# EAGLE design Uni-2.3 (EAGLE 9.6.2)

## Sheet 1 of 4
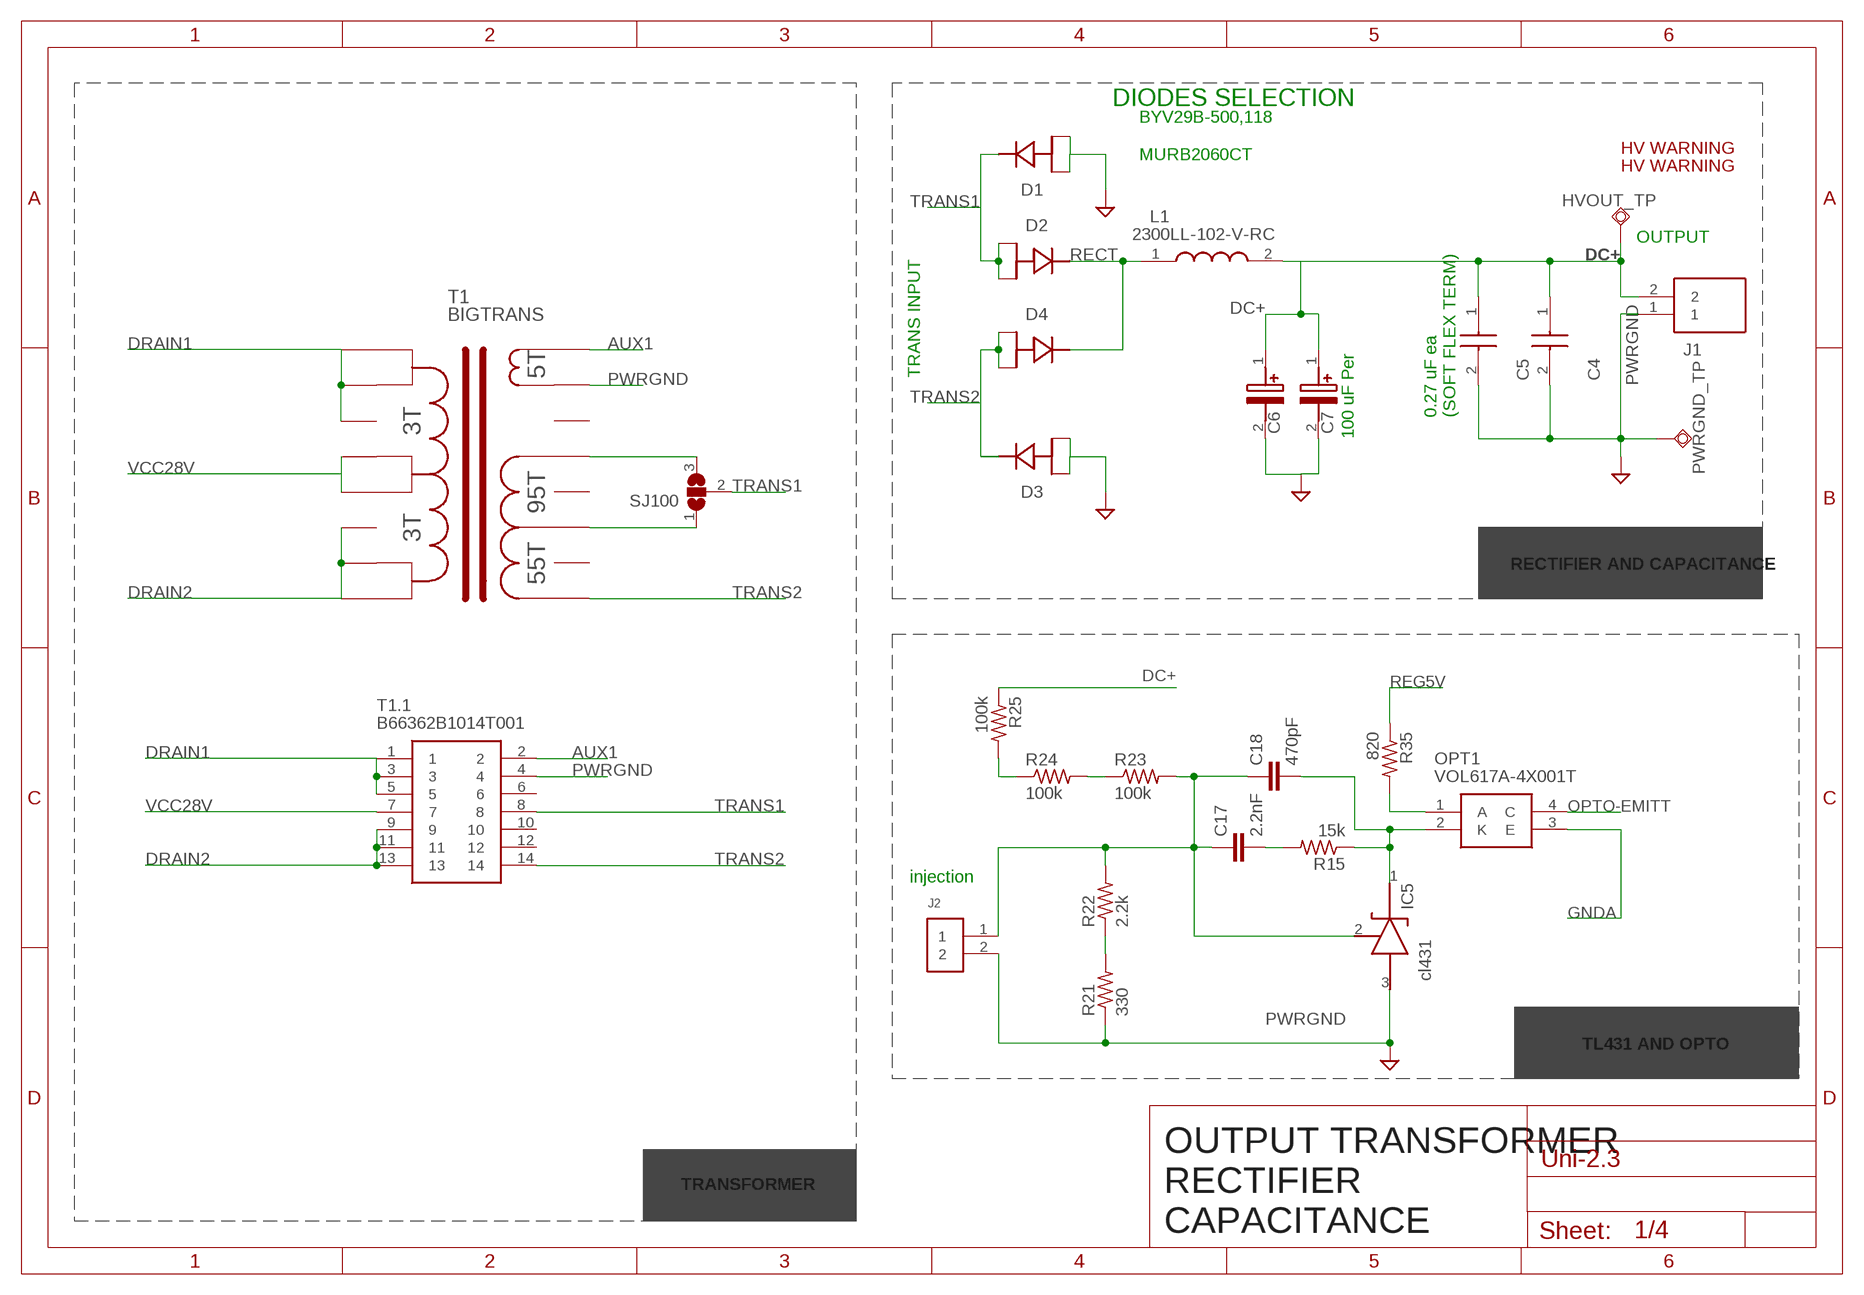
[diagram p0: schematic, sheet 1]

### Parts
C4  C1812C274KCRACAUTO  [C1812]
C5  C1812C274KCRACAUTO  [C1812]
C6  400BXW100MEFR18X25  [CAPPRD750W80D1825H2700]
C7  400BXW100MEFR18X25  [CAPPRD750W80D1825H2700]
C17  2.2nF  C-EUC0603K  [C0603K]
C18  470pF  C-EUC0603K  [C0603K]
D1  FERD20H60CG-TR  [STB20N95K5]
D2  FERD20H60CG-TR  [STB20N95K5]
D3  FERD20H60CG-TR  [STB20N95K5]
D4  FERD20H60CG-TR  [STB20N95K5]
HVOUT_TP  TPSQPAD1-13  [P1-13]
IC5  cl431  TL431CL3T  [SOT95P237X112-3N]
J1  TB005-762-02BE  [TB00576202BE]
J2  61300211121  [61300211121]
L1  2300LL-102-V-RC  [2300LL102VRC]
OPT1  VOL617A-4X001T  [SOP254P1015X230-4N]
PWRGND_TP  TPSQPAD1-13  [P1-13]
R15  15k  R-US_R0603  [R0603]
R21  330  R-US_R0805  [R0805]
R22  2.2k  R-US_R0805  [R0805]
R23  100k  R-US_R1206  [R1206]
R24  100k  R-US_R1206  [R1206]
R25  100k  R-US_R1206  [R1206]
R35  820  R-US_R0603  [R0603]
SJ100  SJ2WW  [SJ_2W]
T1  BIGTRANS  [BIGTRANS!]
T1.1  B66362B1014T001  [B66362B1014T001]
U$3  HV  [PSFBC_ELECTRIC_SHOCK]
U$4  HV  [PSFBC_ELECTRIC_SHOCK]

### Nets
AUX1: T1.1.2 T1.16 ; also sheet 3
DC+: C4.1 C5.1 C6.1(+) C7.1(+) HVOUT_TP.TP J1.2 L1.2 R25.1 ; also sheet 2
DRAIN1: T1.1.1 T1.1.3 T1.1.5 T1.6 T1.7 T1.8 ; also sheet 4
DRAIN2: T1.1 T1.1.9 T1.1.11 T1.1.13 T1.2 T1.3 ; also sheet 4
GNDA: OPT1.3(E) ; also sheet 3,4
N$1: R24.1 R25.2
N$3: C17.1 C18.1 IC5.2(REF) J2.1 R22.2 R23.2
N$9: SJ100.1 T1.11
N$15: R23.1 R24.2
N$16: R21.2 R22.1
N$18: C18.2 IC5.1(CATHODE) OPT1.2(K) R15.1
N$19: OPT1.1(A) R35.2
N$21: C17.2 R15.2
N$25: SJ100.3 T1.13
OPTO-EMITT: OPT1.4(C) ; also sheet 4
PWRGND: C4.2 C5.2 C6.2(-) C7.2(-) D1.1(A1) D1.3(A2) D3.1(A1) D3.3(A2) IC5.3(ANODE) J1.1 J2.2 PWRGND_TP.TP R21.1 T1.1.4 T1.15 ; supply symbol labelled GND ; also sheet 2,3
RECT: D2.2(K) D4.2(K) L1.1
REG5V: R35.1 ; also sheet 3
TRANS1: D1.2(K) D2.1(A1) D2.3(A2) SJ100.2 T1.1.8
TRANS2: D3.2(K) D4.1(A1) D4.3(A2) T1.1.14 T1.9
VCC28V: T1.1.7 T1.4 T1.5 ; also sheet 3,4
Unconnected: T1.1.6 T1.1.10 T1.1.12 T1.10 T1.12 T1.14

### Notes on the sheet
- DIODES SELECTION
- BYV29B-500,118
  
  MURB2060CT
- OUTPUT
- TRANS INPUT
- 0.27 uF ea
  (SOFT FLEX TERM)
- 100 uF Per
- RECTIFIER AND CAPACITANCE
- injection
- TL431 AND OPTO
- TRANSFORMER
- OUTPUT TRANSFORMER
  RECTIFIER
  CAPACITANCE

## Sheet 2 of 4
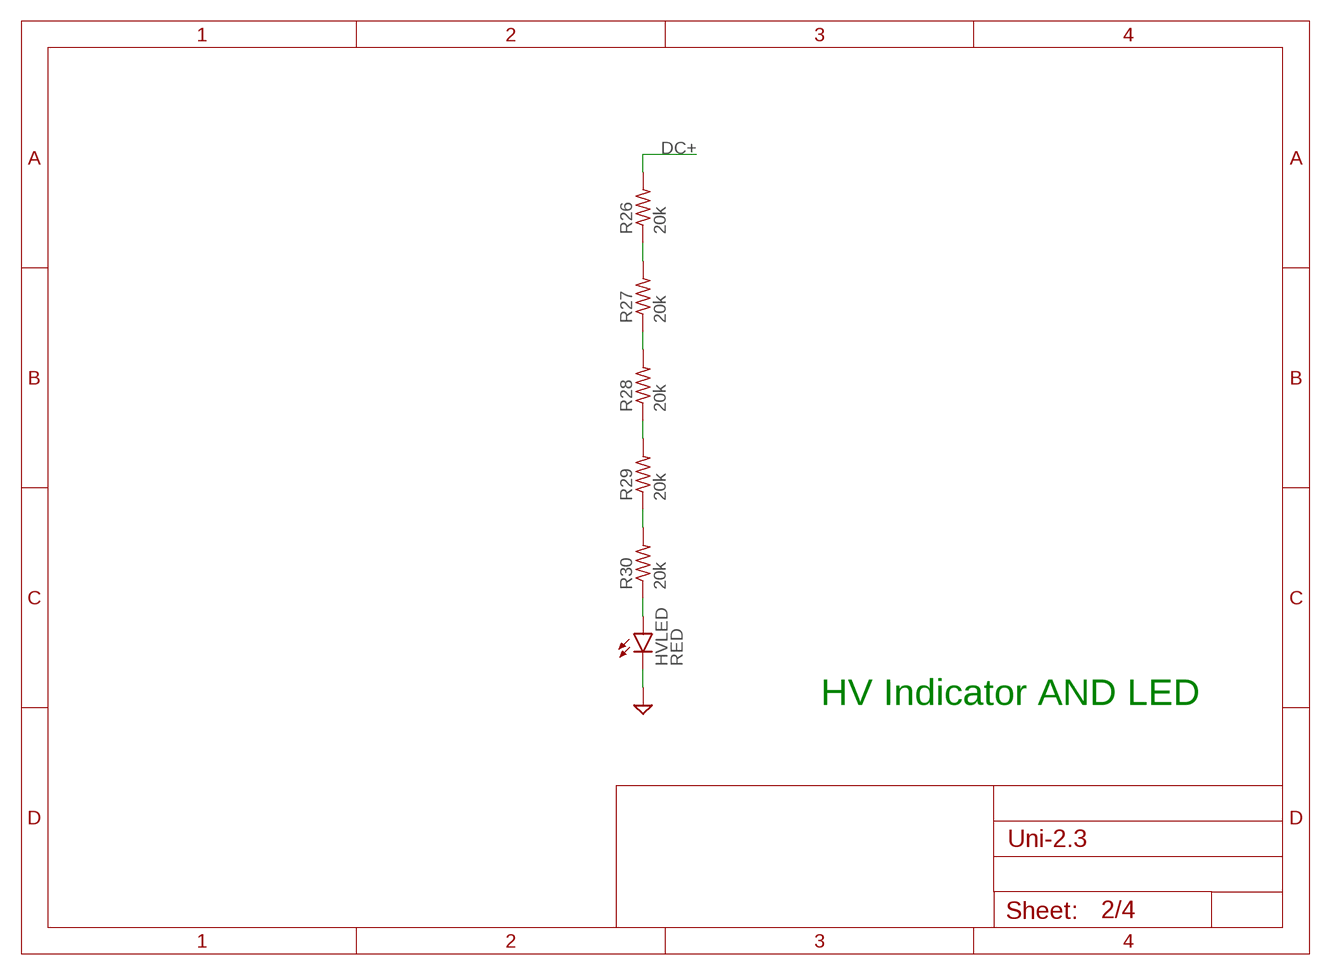
[diagram p1: schematic, sheet 2]

### Parts
HVLED  RED  LEDCHIPLED_0805  [CHIPLED_0805]
R26  20k  R-US_R1206  [R1206]
R27  20k  R-US_R1206  [R1206]
R28  20k  R-US_R1206  [R1206]
R29  20k  R-US_R1206  [R1206]
R30  20k  R-US_R1206  [R1206]

### Nets
DC+: R26.2 ; also sheet 1
N$12: HVLED.A R30.1
N$14: R29.1 R30.2
N$17: R28.1 R29.2
N$24: R27.1 R28.2
N$28: R26.1 R27.2
PWRGND: HVLED.C ; supply symbol labelled GND ; also sheet 1,3

### Notes on the sheet
- HV Indicator AND LED

## Sheet 3 of 4
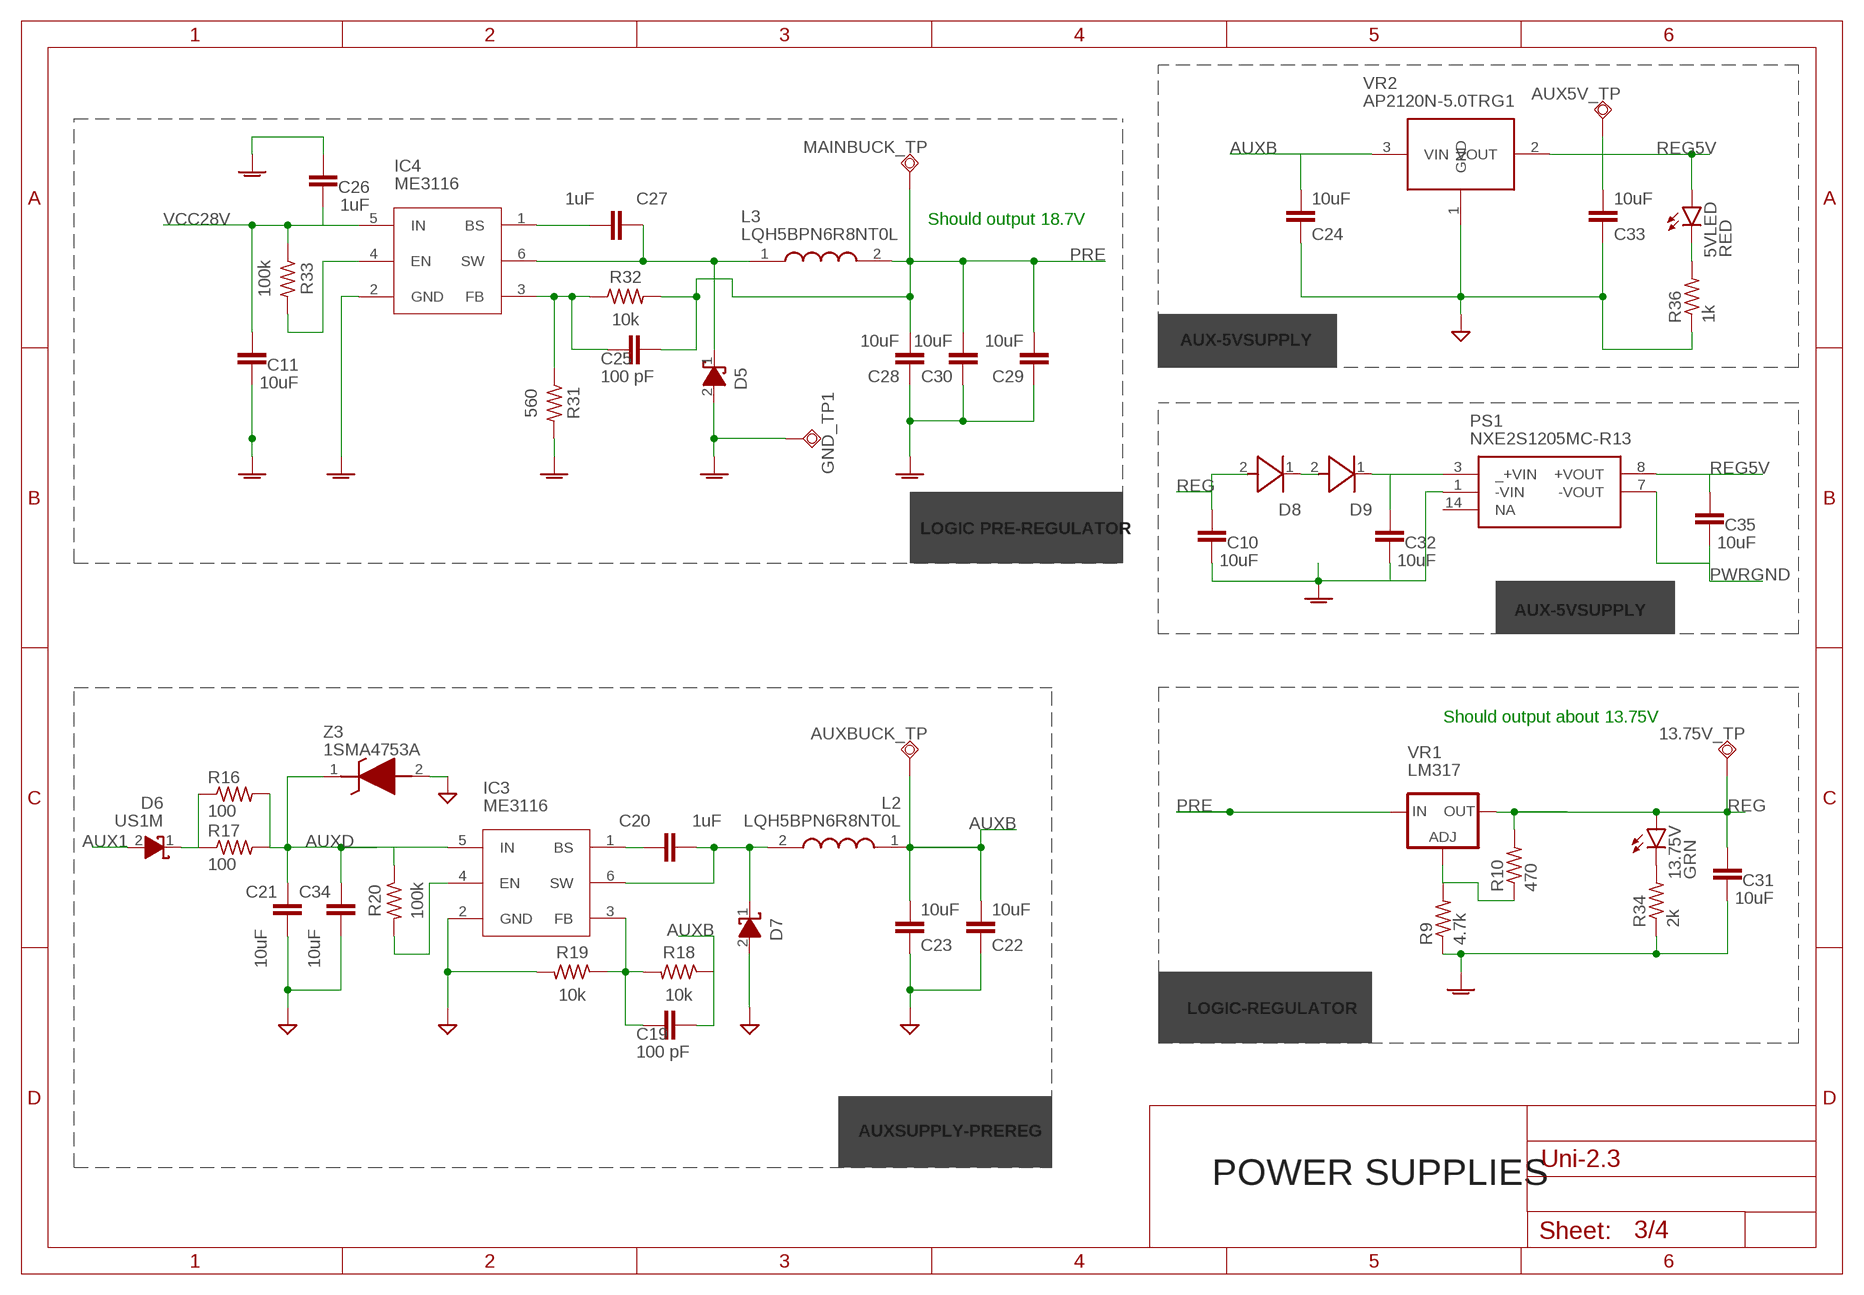
[diagram p2: schematic, sheet 3]

### Parts
5VLED  RED  LEDCHIPLED_0805  [CHIPLED_0805]
13.75V  GRN  LEDCHIPLED_0805  [CHIPLED_0805]
13.75V_TP  TPSQPAD1-17  [P1-17]
AUX5V_TP  TPSQPAD1-17  [P1-17]
AUXBUCK_TP  TPSQPAD1-17  [P1-17]
C10  10uF  C-EUC0805K  [C0805K]
C11  10uF  C-EUC0805K  [C0805K]
C19  100 pF  C-EUC0402K  [C0402K]
C20  1uF  C-EUC0603K  [C0603K]
C21  10uF  C-EUC0805K  [C0805K]
C22  10uF  C-EUC0402  [C0402]
C23  10uF  C-EUC0603K  [C0603K]
C24  10uF  C-EUC0603K  [C0603K]
C25  100 pF  C-EUC0402K  [C0402K]
C26  1uF  C-EUC0603K  [C0603K]
C27  1uF  C-EUC0603K  [C0603K]
C28  10uF  C-EUC0805K  [C0805K]
C29  10uF  C-EUC0805K  [C0805K]
C30  10uF  C-EUC0805K  [C0805K]
C31  10uF  C-EUC0805K  [C0805K]
C32  10uF  C-EUC0603K  [C0603K]
C33  10uF  C-EUC0603K  [C0603K]
C34  10uF  C-EUC0805K  [C0805K]
C35  10uF  C-EUC0603K  [C0603K]
D5  SCHOTTKY  [DIOM5127X229N]
D6  US1M  SCHOTTKY  [DIOM5127X229N]
D7  SCHOTTKY  [DIOM5127X229N]
D8  SM4007PL  1N4148W-7-F  [SOD3716X145N]
D9  SM4007PL  1N4148W-7-F  [SOD3716X145N]
GND_TP1  TPSQPAD1-13  [P1-13]
IC3  ME3116  [SOT95P280X100-6N]
IC4  ME3116  [SOT95P280X100-6N]
L2  LQH5BPN6R8NT0L  [LQH5BPB100MT0L]
L3  LQH5BPN6R8NT0L  [LQH5BPB100MT0L]
MAINBUCK_TP  TPSQPAD1-17  [P1-17]
PS1  NXE2S1205MC-R13  [NXE2S1205MCR13]
R9  4.7k  R-US_R0603  [R0603]
R10  470  R-US_R0603  [R0603]
R16  100  R-US_R1206  [R1206]
R17  100  R-US_R1206  [R1206]
R18  10k  R-US_R0402  [R0402]
R19  10k  R-US_R0402  [R0402]
R20  100k  R-US_R0402  [R0402]
R31  560  R-US_R0402  [R0402]
R32  10k  R-US_R0402  [R0402]
R33  100k  R-US_R0402  [R0402]
R34  2k  R-US_R0603  [R0603]
R36  1k  R-US_R0603  [R0603]
VR1  LM317  LM317MBDT  [DPACK]
VR2  AP2120N-5.0TRG1  [SOT95P240X120-3N]
Z3  1SMA4753A  1SMA5942BT3G  [DIOM5226X220N]

### Nets
AUX1: D6.2(A) ; also sheet 1
AUXB: AUXBUCK_TP.TP C19.1 C22.2 C23.2 C24.2 L2.1 R18.1 VR2.3(VIN)
AUXD: C21.1 C34.1 IC3.5(IN) R16.2 R17.2 R20.1 Z3.1(K)
BS1: C27.2 IC4.1(BS)
BS2: C20.1 IC3.1(BS)
EN1: IC4.4(EN) R33.2
EN2: IC3.4(EN) R20.2
FB1: C25.2 IC4.3(FB) R31.1 R32.1
FB2: C19.2 IC3.3(FB) R18.2 R19.1
GNDA: C10.1 C11.1 C26.2 C28.1 C29.1 C30.1 C31.1 C32.1 D5.2(A) GND_TP1.TP IC4.2(GND) PS1.1(-VIN) R9.1 R31.2 R34.1 ; also sheet 1,4
N$4: D8.1(K) D9.2(A)
N$10: R9.2 R10.1 VR1.1(ADJ)
N$11: C32.2 D9.1(K) PS1.3(_+VIN)
N$22: 13.75V.C R34.2
N$26: 5VLED.C R36.2
N$27: D6.1(K) R16.1 R17.1
PRE: C25.1 C28.2 C29.2 C30.2 L3.2 MAINBUCK_TP.TP R32.2 VR1.3(IN)
PWRGND: C21.2 C22.1 C23.1 C24.1 C33.1 C34.2 C35.1 D7.2(A) IC3.2(GND) PS1.7(-VOUT) R19.2 R36.1 VR2.1(GND) Z3.2(A) ; supply symbol labelled GND ; also sheet 1,2
REG: 13.75V.A 13.75V_TP.TP C10.2 C31.2 D8.2(A) R10.2 VR1.4(OUT) ; also sheet 4
REG5V: 5VLED.A AUX5V_TP.TP C33.2 C35.2 PS1.8(+VOUT) VR2.2(VOUT) ; also sheet 1
SWITCH1: C27.1 D5.1(K) IC4.6(SW) L3.1
SWITCH2: C20.2 D7.1(K) IC3.6(SW) L2.2
VCC28V: C11.2 C26.1 IC4.5(IN) R33.1 ; also sheet 1,4
Unconnected: PS1.14(NA)

### Notes on the sheet
- Should output 18.7V
- AUX-5VSUPPLY
- LOGIC PRE-REGULATOR
- AUX-5VSUPPLY
- Should output about 13.75V
- LOGIC-REGULATOR
- AUXSUPPLY-PREREG
- POWER SUPPLIES

## Sheet 4 of 4
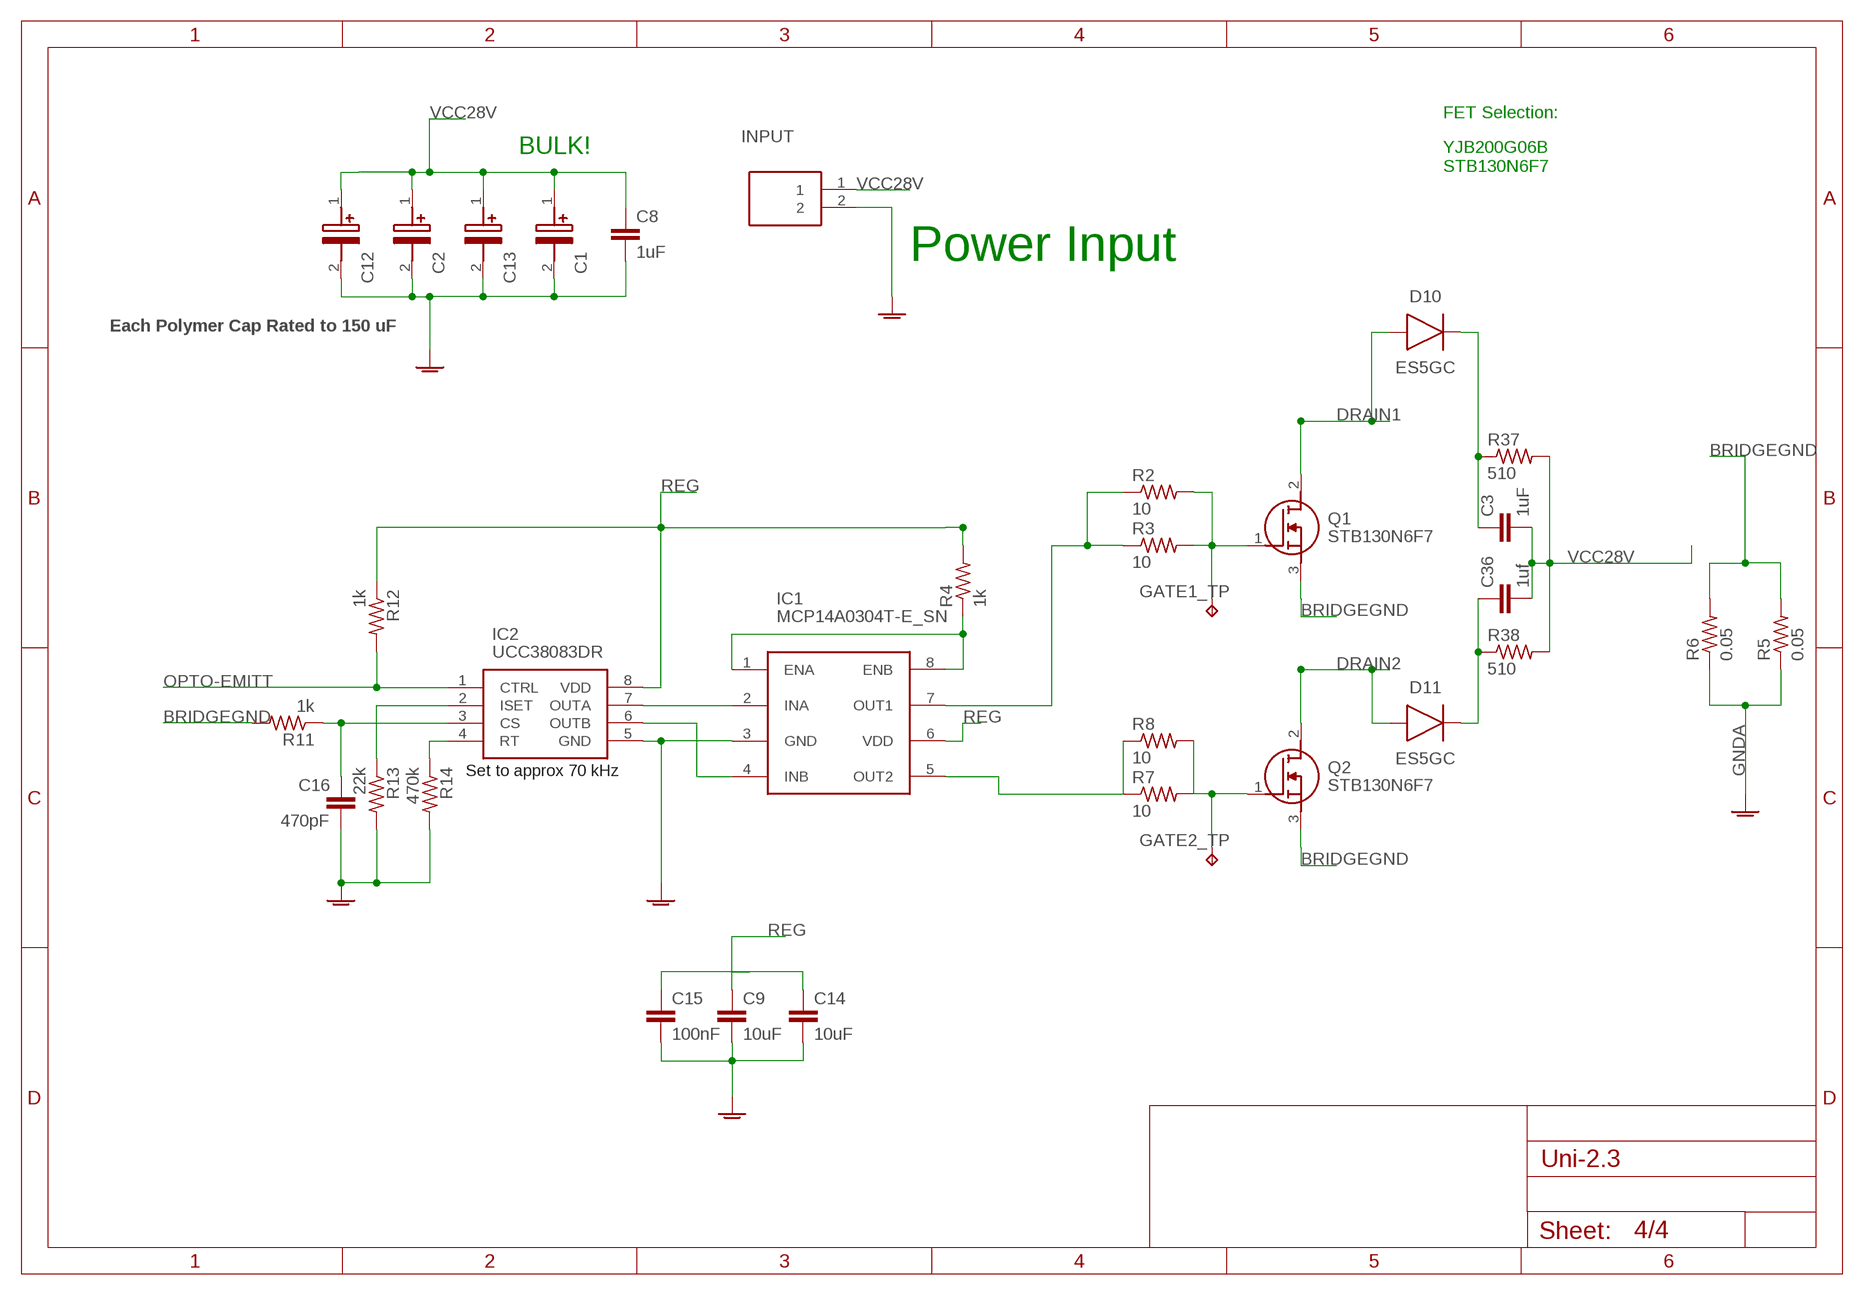
[diagram p3: schematic, sheet 4]

### Parts
C1  OVK151M1VTR-10131  [16SVF1000M]
C2  OVK151M1VTR-10131  [16SVF1000M]
C3  1uF  C-EUC1206K  [C1206K]
C8  1uF  C-EUC0805K  [C0805K]
C9  10uF  C-EUC0603K  [C0603K]
C12  OVK151M1VTR-10131  [16SVF1000M]
C13  OVK151M1VTR-10131  [16SVF1000M]
C14  10uF  C-EUC0603K  [C0603K]
C15  100nF  C-EUC0603K  [C0603K]
C16  470pF  C-EUC0603K  [C0603K]
C36  1uf  C-EUC1206K  [C1206K]
D10  ES5GC  DIODEDO-214AC(SMA)  [DIOM5226X290N]
D11  ES5GC  DIODEDO-214AC(SMA)  [DIOM5226X290N]
GATE1_TP  TPTP13R  [TP13R]
GATE2_TP  TPTP13R  [TP13R]
IC1  MCP14A0304T-E_SN  [SOIC127P600X175-8N]
IC2  UCC38083DR  [SOIC127P600X175-8N]
INPUT  TB005-762-02BE  [TB00576202BE]
Q1  STB130N6F7  [D2PAK]
Q2  STB130N6F7  [D2PAK]
R2  10  R-US_R0805  [R0805]
R3  10  R-US_R0805  [R0805]
R4  1k  R-US_R0402  [R0402]
R5  0.05  R-US_R2512  [R2512]
R6  0.05  R-US_R2512  [R2512]
R7  10  R-US_R0805  [R0805]
R8  10  R-US_R0805  [R0805]
R11  1k  R-US_R0603  [R0603]
R12  1k  R-US_R0603  [R0603]
R13  22k  R-US_R0603  [R0603]
R14  470k  R-US_R0603  [R0603]
R37  510  R-US_R2512  [R2512]
R38  510  R-US_R2512  [R2512]

### Nets
BRIDGEGND: Q1.3(S) Q2.3(S) R5.2 R6.2 R11.2
CS-IN: C16.1 IC2.3(CS) R11.1
DRAIN1: D10.2(A) Q1.2(D) ; also sheet 1
DRAIN2: D11.2(A) Q2.2(D) ; also sheet 1
GNDA: C1.2(-) C2.2(-) C8.2 C9.2 C12.2(-) C13.2(-) C14.2 C15.2 C16.2 IC1.3(GND) IC2.5(GND) INPUT.2 R5.1 R6.1 R13.2 R14.2 ; also sheet 1,3
N$2: IC1.2(INA) IC2.7(OUTA)
N$5: IC1.4(INB) IC2.6(OUTB)
N$6: IC1.1(ENA) IC1.8(ENB) R4.1
N$7: IC1.7(OUT1) R2.1 R3.1
N$8: IC1.5(OUT2) R7.1 R8.1
N$13: IC2.2(ISET) R13.1
N$20: C3.1 D10.1(C) R37.1
N$23: C36.1 D11.1(C) R38.1
OPTO-EMITT: IC2.1(CTRL) R12.2 ; also sheet 1
Q1G: GATE1_TP.TP Q1.1(G) R2.2 R3.2
Q2G: GATE2_TP.TP Q2.1(G) R7.2 R8.2
REG: C9.1 C14.1 C15.1 IC1.6(VDD) IC2.8(VDD) R4.2 R12.1 ; also sheet 3
RT: IC2.4(RT) R14.1
VCC28V: C1.1(+) C2.1(+) C3.2 C8.1 C12.1(+) C13.1(+) C36.2 INPUT.1 R37.2 R38.2 ; also sheet 1,3

### Notes on the sheet
- FET Selection:
- BULK!
- YJB200G06B
  STB130N6F7
- Power Input
- Each Polymer Cap Rated to 150 uF
- Set to approx 70 kHz

## Library data of the parts
5VLED 13.75V = led:LED: LED OSRAM: - CHIPLED LG R971, LG N971, LY N971, LG Q971, LY Q971, LO R971, LY R971 LH N974, LH R974 LS Q976, LO Q976, LY Q976 LO Q996 - Hyper CHIPLED LW Q18S LB Q993, LB Q99A, LB R99A - SideLED LS A670, LO A670, LY A670, LG A670, LP A670 LB A673, LV A673, LT A673, LW A673 LH A674 LY A675 LS A676, LA A676, LO A676, LY A676, LW A676 LS A679, LY A679, LG A679 - Hyper Micro SIDELED® LS Y876, LA Y876, LO Y876, LY Y876 LT Y87S - SmartLED LW L88C, LW L88S LB L89C, LB L89S, LG L890 LS L89K, LO L89K, LY L89K LS L896, LA L896, LO L896, LY L896 - TOPLED LS T670, LO T670, LY T670, LG T670, LP T670 LSG T670, LSP T670, LSY T670, LOP T670, LYG T670 LG T671, LOG T671, LSG T671 LB T673, LV T673, LT T673, LW T673 LH T674 LS T676, LA T676, LO T676, LY T676, LB T676, LH T676, LSB T676, LW T676 LB T67C, LV T67C, LT T67C, LS T67K, LO T67K, LY T67K, LW E67C LS E67B, LA E67B, LO E67B, LY E67B, LB E67C, LV E67C, LT E67C LW T67C LS T679, LY T679, LG T679 LS T770, LO T770, LY T770, LG T770, LP T770 LB T773, LV T773, LT T773, LW T773 LH T774 LS E675, LA E675, LY E675, LS T675 LS T776, LA T776, LO T776, LY T776, LB T776 LHGB T686 LT T68C, LB T68C - Hyper Mini TOPLED® LB M676 - Mini TOPLED Santana® LG M470 LS M47K, LO M47K, LY M47K Source: http://www.osram.convergy.de LUXEON: - LUMILED® LXK2-PW12-R00, LXK2-PW12-S00, LXK2-PW14-U00, LXK2-PW14-V00 LXK2-PM12-R00, LXK2-PM12-S00, LXK2-PM14-U00 LXK2-PE12-Q00, LXK2-PE12-R00, LXK2-PE12-S00, LXK2-PE14-T00, LXK2-PE14-U00 LXK2-PB12-K00, LXK2-PB12-L00, LXK2-PB12-M00, LXK2-PB14-N00, LXK2-PB14-P00, LXK2-PB14-Q00 LXK2-PR12-L00, LXK2-PR12-M00, LXK2-PR14-Q00, LXK2-PR14-R00 LXK2-PD12-Q00, LXK2-PD12-R00, LXK2-PD12-S00 LXK2-PH12-R00, LXK2-PH12-S00 LXK2-PL12-P00, LXK2-PL12-Q00, LXK2-PL12-R00 Source: www.luxeon.com KINGBRIGHT: KA-3528ASYC Source: www.kingbright.com; LCSC_PART: C72043
13.75V_TP AUX5V_TP AUXBUCK_TP GND_TP1 HVOUT_TP MAINBUCK_TP PWRGND_TP = testpad:TPSQ: Test pad
C1 C2 C12 C13 = SamacSys_Parts:OVK151M1VTR-1013: OVK151M1VTR-1013
C3 C17 C18 C21 C33 C34 C36 = rcl:C-EU: CAPACITOR, European symbol; SPICEPREFIX: C
C4 C5 = SamacSys_Parts:C1812C274KCRACAUTO: SMD Auto X7R HV, Ceramic, 0.27 uF, 10%, 500 VDC, 750 VDC, 125?C, -55?C, X7R, SMD, MLCC, High Voltage, Temperature Stable, Automotive Grade, 2.5 % , 370.4 MOhms, 185 mg, 1812, 4.5mm, 3.2mm, 1.9mm, 0.6mm, 500, 78 Weeks, 80 Source: Datasheet <https://componentsearchengine.com/Datasheets/1/C1812C274KCRACAUTO.pdf>; DESCRIPTION: SMD Auto X7R HV, Ceramic, 0.27 uF, 10%, 500 VDC, 750 VDC, 125?C, -55?C, X7R, SMD, MLCC, High Voltage, Temperature Stable, Automotive Grade, 2.5 % , 370.4 MOhms, 185 mg, 1812, 4.5mm, 3.2mm, 1.9mm, 0.6mm, 500, 78 Weeks, 80; HEIGHT: 1.55mm; MANUFACTURER_NAME: KEMET; MANUFACTURER_PART_NUMBER: C1812C274KCRACAUTO; MOUSER_PART_NUMBER: 80-C1812C274KCRAUTO; MOUSER_PRICE-STOCK: https://www.mouser.com/Search/Refine.aspx?Keyword=80-C1812C274KCRAUTO
C6 C7 = SamacSys_Parts:400BXW100MEFR18X25: Aluminum Electrolytic Capacitors - Radial Leaded LONG LIFE ELECTROLYTIC CAPACITORS Source: Datasheet <http://www.rubycon.co.jp/en/catalog/e_pdfs/aluminum/e_BXW.pdf>; DESCRIPTION: Aluminum Electrolytic Capacitors - Radial Leaded LONG LIFE ELECTROLYTIC CAPACITORS; HEIGHT: 27mm; MANUFACTURER_NAME: Rubycon; MANUFACTURER_PART_NUMBER: 400BXW100MEFR18X25
C8 C9 C14 C15 C22-C24 C26 C32 C35 = rcl:C-EU: CAPACITOR, European symbol; LCSC_PART: C440198; SPICEPREFIX: C
C10 C11 C28-C31 = rcl:C-EU: CAPACITOR, European symbol; LCSC_PART: C440198
C16 = rcl:C-EU: CAPACITOR, European symbol; LCSC_PART: C1620; SPICEPREFIX: C
C19 C25 = rcl:C-EU: CAPACITOR, European symbol; LCSC_PART: C1546; SPICEPREFIX: C
C20 C27 = rcl:C-EU: CAPACITOR, European symbol; LCSC_PART: C14663; SPICEPREFIX: C
D1-D4 = SamacSys_Parts:FERD20H60CG-TR: Rectifiers Field-Effect Rectifier Diode 60V Source: Datasheet <https://www.st.com/resource/en/datasheet/ferd20h60c.pdf>; DESCRIPTION: Rectifiers Field-Effect Rectifier Diode 60V; HEIGHT: 4mm; MANUFACTURER_NAME: STMicroelectronics; MANUFACTURER_PART_NUMBER: FERD20H60CG-TR; MOUSER_PART_NUMBER: 511-FERD20H60CG-TR; MOUSER_PRICE-STOCK: https://www.mouser.co.uk/ProductDetail/STMicroelectronics/FERD20H60CG-TR?qs=1mbolxNpo8ebHpKodyoUCQ%3D%3D
D5 D7 = SamacSys_Parts:SCHOTTKY: Schottky Diodes & Rectifiers 60V Sctky Bar Rectfr SMA (DO-214AC) Source: Datasheet <https://www.arrow.com/en/products/ss16he3-bh/vishay>; DESCRIPTION: Schottky Diodes & Rectifiers 60V Sctky Bar Rectfr SMA (DO-214AC); HEIGHT: 2.29mm; LCSC_PART: C22452; MANUFACTURER_NAME: Vishay; MANUFACTURER_PART_NUMBER: SS16HE3_B/H; MOUSER_PART_NUMBER: 78-SS16HE3_B/H; MOUSER_PRICE-STOCK: https://www.mouser.co.uk/ProductDetail/Vishay-General-Semiconductor/SS16HE3_B-H?qs=MLItCLRbWsyJmaJ87KUvIw%3D%3D
D6 = SamacSys_Parts:SCHOTTKY: Schottky Diodes & Rectifiers 60V Sctky Bar Rectfr SMA (DO-214AC) Source: Datasheet <https://www.arrow.com/en/products/ss16he3-bh/vishay>; DESCRIPTION: Schottky Diodes & Rectifiers 60V Sctky Bar Rectfr SMA (DO-214AC); HEIGHT: 2.29mm; MANUFACTURER_NAME: Vishay; MANUFACTURER_PART_NUMBER: SS16HE3_B/H; MOUSER_PART_NUMBER: 78-SS16HE3_B/H; MOUSER_PRICE-STOCK: https://www.mouser.co.uk/ProductDetail/Vishay-General-Semiconductor/SS16HE3_B-H?qs=MLItCLRbWsyJmaJ87KUvIw%3D%3D
D8 D9 = SamacSys_Parts:1N4148W-7-F: Diode Switching 150mA 100V 400mW SOD123 Diodes Inc 1N4148W-7-F Switching Diode 100V, 2-Pin SOD-123 Source: Datasheet <https://componentsearchengine.com/Datasheets/2/1N4148W-7-F.pdf>; DESCRIPTION: Diode Switching 150mA 100V 400mW SOD123 Diodes Inc 1N4148W-7-F Switching Diode 100V, 2-Pin SOD-123; HEIGHT: 1.45mm; LCSC_PART: C64898; MANUFACTURER_NAME: Diodes Inc.; MANUFACTURER_PART_NUMBER: 1N4148W-7-F; MOUSER_PART_NUMBER: 621-1N4148W-F; MOUSER_PRICE-STOCK: https://www.mouser.co.uk/ProductDetail/Diodes-Incorporated/1N4148W-7-F?qs=LHX0FizJzg7Ae9ZM8LTAWw%3D%3D
D10 = Diode:DIODE: Diode Rectifier - Generic; CATEGORY: Diode; LCSC_PART: C128705; SUB-CATEGORY: Rectifier; VALUE: DIODE
D11 = Diode:DIODE: Diode Rectifier - Generic; CATEGORY: Diode; SUB-CATEGORY: Rectifier; VALUE: DIODE
GATE1_TP GATE2_TP = testpad:TP: Test pad
HVLED = led:LED: LED OSRAM: - CHIPLED LG R971, LG N971, LY N971, LG Q971, LY Q971, LO R971, LY R971 LH N974, LH R974 LS Q976, LO Q976, LY Q976 LO Q996 - Hyper CHIPLED LW Q18S LB Q993, LB Q99A, LB R99A - SideLED LS A670, LO A670, LY A670, LG A670, LP A670 LB A673, LV A673, LT A673, LW A673 LH A674 LY A675 LS A676, LA A676, LO A676, LY A676, LW A676 LS A679, LY A679, LG A679 - Hyper Micro SIDELED® LS Y876, LA Y876, LO Y876, LY Y876 LT Y87S - SmartLED LW L88C, LW L88S LB L89C, LB L89S, LG L890 LS L89K, LO L89K, LY L89K LS L896, LA L896, LO L896, LY L896 - TOPLED LS T670, LO T670, LY T670, LG T670, LP T670 LSG T670, LSP T670, LSY T670, LOP T670, LYG T670 LG T671, LOG T671, LSG T671 LB T673, LV T673, LT T673, LW T673 LH T674 LS T676, LA T676, LO T676, LY T676, LB T676, LH T676, LSB T676, LW T676 LB T67C, LV T67C, LT T67C, LS T67K, LO T67K, LY T67K, LW E67C LS E67B, LA E67B, LO E67B, LY E67B, LB E67C, LV E67C, LT E67C LW T67C LS T679, LY T679, LG T679 LS T770, LO T770, LY T770, LG T770, LP T770 LB T773, LV T773, LT T773, LW T773 LH T774 LS E675, LA E675, LY E675, LS T675 LS T776, LA T776, LO T776, LY T776, LB T776 LHGB T686 LT T68C, LB T68C - Hyper Mini TOPLED® LB M676 - Mini TOPLED Santana® LG M470 LS M47K, LO M47K, LY M47K Source: http://www.osram.convergy.de LUXEON: - LUMILED® LXK2-PW12-R00, LXK2-PW12-S00, LXK2-PW14-U00, LXK2-PW14-V00 LXK2-PM12-R00, LXK2-PM12-S00, LXK2-PM14-U00 LXK2-PE12-Q00, LXK2-PE12-R00, LXK2-PE12-S00, LXK2-PE14-T00, LXK2-PE14-U00 LXK2-PB12-K00, LXK2-PB12-L00, LXK2-PB12-M00, LXK2-PB14-N00, LXK2-PB14-P00, LXK2-PB14-Q00 LXK2-PR12-L00, LXK2-PR12-M00, LXK2-PR14-Q00, LXK2-PR14-R00 LXK2-PD12-Q00, LXK2-PD12-R00, LXK2-PD12-S00 LXK2-PH12-R00, LXK2-PH12-S00 LXK2-PL12-P00, LXK2-PL12-Q00, LXK2-PL12-R00 Source: www.luxeon.com KINGBRIGHT: KA-3528ASYC Source: www.kingbright.com
IC1 = SamacSys_Parts:MCP14A0304T-E_SN: Microchip Technology MCP14A0304T-E/SN Dual Low Side MOSFET Power Driver, 3A 8-Pin, SOIC Source: Datasheet <http://www.microchip.com/mymicrochip/filehandler.aspx?ddocname=en606629>; DESCRIPTION: Microchip Technology MCP14A0304T-E/SN Dual Low Side MOSFET Power Driver, 3A 8-Pin, SOIC; HEIGHT: 1.75mm; MANUFACTURER_NAME: Microchip; MANUFACTURER_PART_NUMBER: MCP14A0304T-E/SN; MOUSER_PART_NUMBER: 579-MCP14A0304T-E/SN; MOUSER_PRICE-STOCK: https://www.mouser.co.uk/ProductDetail/Microchip-Technology/MCP14A0304T-E-SN?qs=w%2Fv1CP2dgqqqWUCaoFqV0w%3D%3D
IC2 = SamacSys_Parts:UCC38083DR: Current Mode Push-Pull PWM With Programmable Slope Compensation Source: Datasheet <http://www.ti.com/lit/gpn/ucc38083>; DESCRIPTION: Current Mode Push-Pull PWM With Programmable Slope Compensation; HEIGHT: 1.75mm; MANUFACTURER_NAME: Texas Instruments; MANUFACTURER_PART_NUMBER: UCC38083DR; MOUSER_PART_NUMBER: 595-UCC38083DR; MOUSER_PRICE-STOCK: https://www.mouser.co.uk/ProductDetail/Texas-Instruments/UCC38083DR/?qs=zqbRmZ%252BfZD9Rvt3ie7yhvg%3D%3D
IC3 IC4 = SamacSys_Parts:ME3116; LCSC_PART: C97643
IC5 = SamacSys_Parts:TL431CL3T: Adjustable micropower shunt voltage reference Source: Datasheet <https://www.st.com/resource/en/datasheet/tl431.pdf>; DESCRIPTION: Adjustable micropower shunt voltage reference; HEIGHT: 1.12mm; MANUFACTURER_NAME: STMicroelectronics; MANUFACTURER_PART_NUMBER: TL431CL3T; MOUSER_PART_NUMBER: 511-TL431CL3T; MOUSER_PRICE-STOCK: https://www.mouser.co.uk/ProductDetail/STMicroelectronics/TL431CL3T?qs=L6eUzyzWLAsU2SYO1NdhdA%3D%3D
INPUT J1 = SamacSys_Parts:TB005-762-02BE: Fixed Terminal Blocks screw type, 7.62 , horizontal, 2 poles, CUI Blue, slotted screw, PCB mount Source: Datasheet <https://componentsearchengine.com/Datasheets/1/TB005-762-02BE.pdf>; DESCRIPTION: Fixed Terminal Blocks screw type, 7.62 , horizontal, 2 poles, CUI Blue, slotted screw, PCB mount; HEIGHT: 21.7mm; MANUFACTURER_NAME: CUI Inc.; MANUFACTURER_PART_NUMBER: TB005-762-02BE; MOUSER_PART_NUMBER: 490-TB005-762-02BE; MOUSER_PRICE-STOCK: https://www.mouser.co.uk/ProductDetail/CUI-Devices/TB005-762-02BE?qs=vLWxofP3U2zXv1H2wuShow%3D%3D
J2 = Headers:61300211121: CONN HEADER VERT 2POS 2.54MM Manufacturer's datasheet <https://katalog.we-online.de/em/datasheet/6130xx11121.pdf>; CREATED_BY: PCBLayout.com; DIGI_KEY_PART_NUMBER: 732-5315-ND; MANUFACTURER: Wurth Electronics Inc.; MPN: 61300211121
L1 = SamacSys_Parts:2300LL-102-V-RC: Inductor High Current Toroid 1000uH/378.9uH 15% 1KHz 3.5A 137mOhm DCR RDL Source: Datasheet; DESCRIPTION: Inductor High Current Toroid 1000uH/378.9uH 15% 1KHz 3.5A 137mOhm DCR RDL; HEIGHT: 32.512mm; MANUFACTURER_NAME: Bourns; MANUFACTURER_PART_NUMBER: 2300LL-102-V-RC; MOUSER_PART_NUMBER: 652-2300LL-102-V-RC; MOUSER_PRICE-STOCK: https://www.mouser.co.uk/ProductDetail/Bourns/2300LL-102-V-RC?qs=d7g9p1yFhWZHzfawXthNnQ%3D%3D
L2 L3 = SamacSys_Parts:LQH5BPN6R8NT0L: MURATA - LQH5BPN6R8NT0L - INDUCTOR, 6.8UH, +/-30%, POWER Source: Datasheet <https://psearch.en.murata.com/inductor/product/LQH5BPN6R8NT0#.html>; DESCRIPTION: MURATA - LQH5BPN6R8NT0L - INDUCTOR, 6.8UH, +/-30%, POWER; HEIGHT: 2.2mm; MANUFACTURER_NAME: Murata Electronics; MANUFACTURER_PART_NUMBER: LQH5BPN6R8NT0L; MOUSER_PART_NUMBER: 81-LQH5BPN6R8NT0L0L; MOUSER_PRICE-STOCK: https://www.mouser.co.uk/ProductDetail/Murata-Electronics/LQH5BPN6R8NT0L?qs=3ZwS9AhGA%2F4N8axqd87eRQ%3D%3D
OPT1 = SamacSys_Parts:VOL617A-4X001T: Vishay VOL617A-4X001T DC Input Phototransistor Output Optocoupler, Surface Mount, 4-Pin LSOP Source: Datasheet <https://www.vishay.com/docs/82424/vol617a.pdf>; DESCRIPTION: Vishay VOL617A-4X001T DC Input Phototransistor Output Optocoupler, Surface Mount, 4-Pin LSOP; HEIGHT: 2.3mm; MANUFACTURER_NAME: Vishay; MANUFACTURER_PART_NUMBER: VOL617A-4X001T; MOUSER_PART_NUMBER: 78-VOL617A-4X001T; MOUSER_PRICE-STOCK: https://www.mouser.co.uk/ProductDetail/Vishay-Semiconductors/VOL617A-4X001T?qs=s4XK1XdnRilEoTFGQUoymA%3D%3D
PS1 = SamacSys_Parts:NXE2S1205MC-R13: Isolated DC/DC Converters DC/DC SM 2W 12-5V Single 3kV Source: Datasheet; DESCRIPTION: Isolated DC/DC Converters DC/DC SM 2W 12-5V Single 3kV; HEIGHT: 4.81mm; MANUFACTURER_NAME: Murata Electronics; MANUFACTURER_PART_NUMBER: NXE2S1205MC-R13; MOUSER_PART_NUMBER: 580-NXE2S1205MC-R13; MOUSER_PRICE-STOCK: https://www.mouser.co.uk/ProductDetail/Murata-Power-Solutions/NXE2S1205MC-R13?qs=UqPySVGgRwFuSegQbHt7Hw%3D%3D
Q1 Q2 = SamacSys_Parts:STB130N6F7
R2-R8 R15-R17 R21-R30 R35 R37 R38 = rcl:R-US_: RESISTOR, American symbol; SPICEPREFIX: R
R9 R10 R12 R34 R36 = rcl:R-US_: RESISTOR, American symbol; LCSC_PART: C22975; SPICEPREFIX: R
R11 = rcl:R-US_: RESISTOR, American symbol; LCSC_PART: C21190; SPICEPREFIX: R
R13 = rcl:R-US_: RESISTOR, American symbol; LCSC_PART: C31850; SPICEPREFIX: R
R14 = rcl:R-US_: RESISTOR, American symbol; LCSC_PART: C25811; SPICEPREFIX: R
R18 R19 R32 = rcl:R-US_: RESISTOR, American symbol; LCSC_PART: C25779; SPICEPREFIX: R
R20 R33 = rcl:R-US_: RESISTOR, American symbol; LCSC_PART: C25741; SPICEPREFIX: R
R31 = rcl:R-US_: RESISTOR, American symbol; LCSC_PART: C4177; SPICEPREFIX: R
SJ100 = jumper:SJ2W: SMD solder JUMPER
T1 = SamacSys_Parts:BIGTRANS
T1.1 = SamacSys_Parts:B66362B1014T001: Ferrite Accessories, E Cores Accessories(EFD/ER/ETD), Coil former (ETD 34/17/11) Source: Datasheet <https://product.tdk.com/system/files/dam/doc/product/ferrite/ferrite/ferrite-acc/data_sheet/80/db/fer/etd_34_17_11.pdf>; DESCRIPTION: Ferrite Accessories, E Cores Accessories(EFD/ER/ETD), Coil former (ETD 34/17/11); HEIGHT: 33.1mm; MANUFACTURER_NAME: TDK; MANUFACTURER_PART_NUMBER: B66362B1014T001; MOUSER_PART_NUMBER: 871-B66362B1014T001; MOUSER_PRICE-STOCK: https://www.mouser.co.uk/ProductDetail/EPCOS-TDK/B66362B1014T001?qs=w5o0Loj0u7M9FVK%2Ff7P38g%3D%3D
U$3 U$4 = RMP - HALF BRIDGE 0.0.1:HV
VR1 = v-reg:LM317?*: 500 mA Adjustable Output Positive Voltage Regulator Source: http://www.onsemi.co.jp .. LM317M-D.PDF
VR2 = SamacSys_Parts:AP2120N-5.0TRG1: IC REG LINEAR 5V 150MA SOT23 Source: Datasheet; DESCRIPTION: IC REG LINEAR 5V 150MA SOT23; HEIGHT: 1.2mm; MANUFACTURER_NAME: Diodes Inc.; MANUFACTURER_PART_NUMBER: AP2120N-5.0TRG1; MOUSER_PART_NUMBER: 621-AP2120N-5.0TRG1; MOUSER_PRICE-STOCK: https://www.mouser.co.uk/ProductDetail/Diodes-Incorporated/AP2120N-50TRG1?qs=M%2FOdCRO8QQ3JQu49DdtyIA%3D%3D
Z3 = SamacSys_Parts:1SMA5942BT3G: ON Semiconductor 1SMA5942BT3G Zener Diode, 51V 5% 1.5 W SMT 2-Pin SMA Source: Datasheet <http://www.onsemi.com/pub/Collateral/1SMA5913BT3-D.PDF>; DESCRIPTION: ON Semiconductor 1SMA5942BT3G Zener Diode, 51V 5% 1.5 W SMT 2-Pin SMA; HEIGHT: 2.2mm; LCSC_PART: C362284; MANUFACTURER_NAME: onsemi; MANUFACTURER_PART_NUMBER: 1SMA5942BT3G; MOUSER_PART_NUMBER: 863-1SMA5942BT3G; MOUSER_PRICE-STOCK: https://www.mouser.co.uk/ProductDetail/ON-Semiconductor/1SMA5942BT3G?qs=y2kkmE52mdPrQGqg%252Bfz9yg%3D%3D

## Board
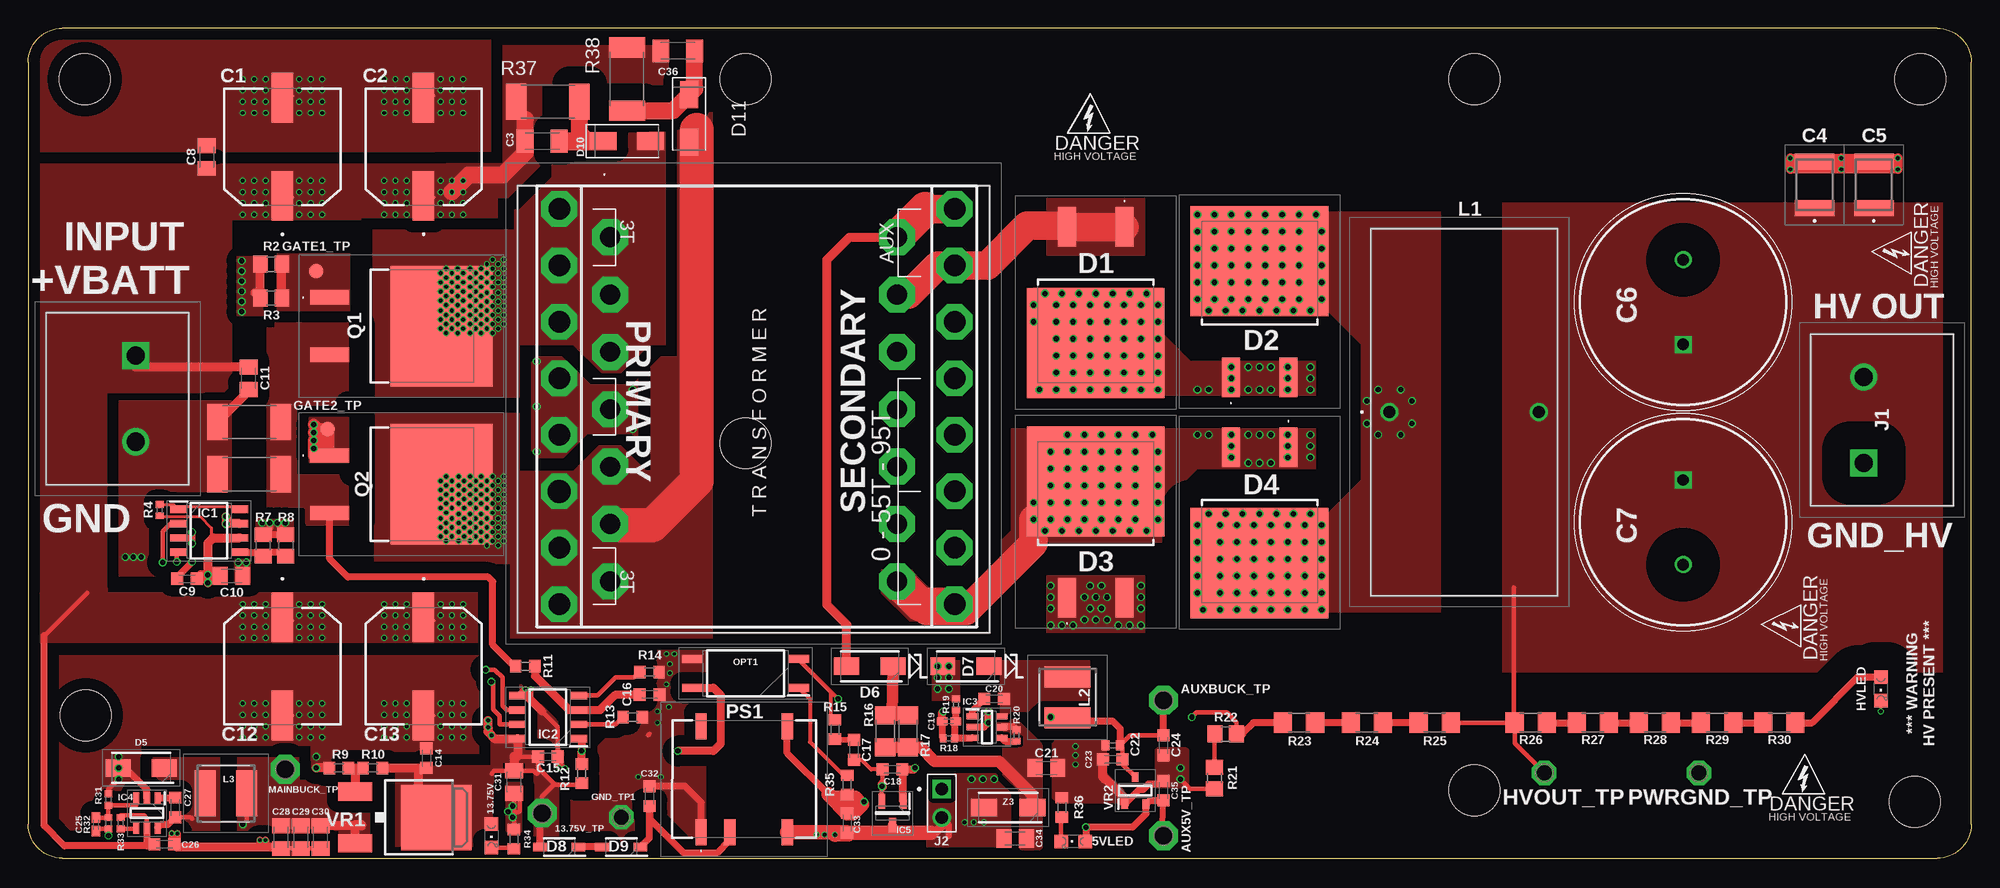
[diagram p4: board, top side]
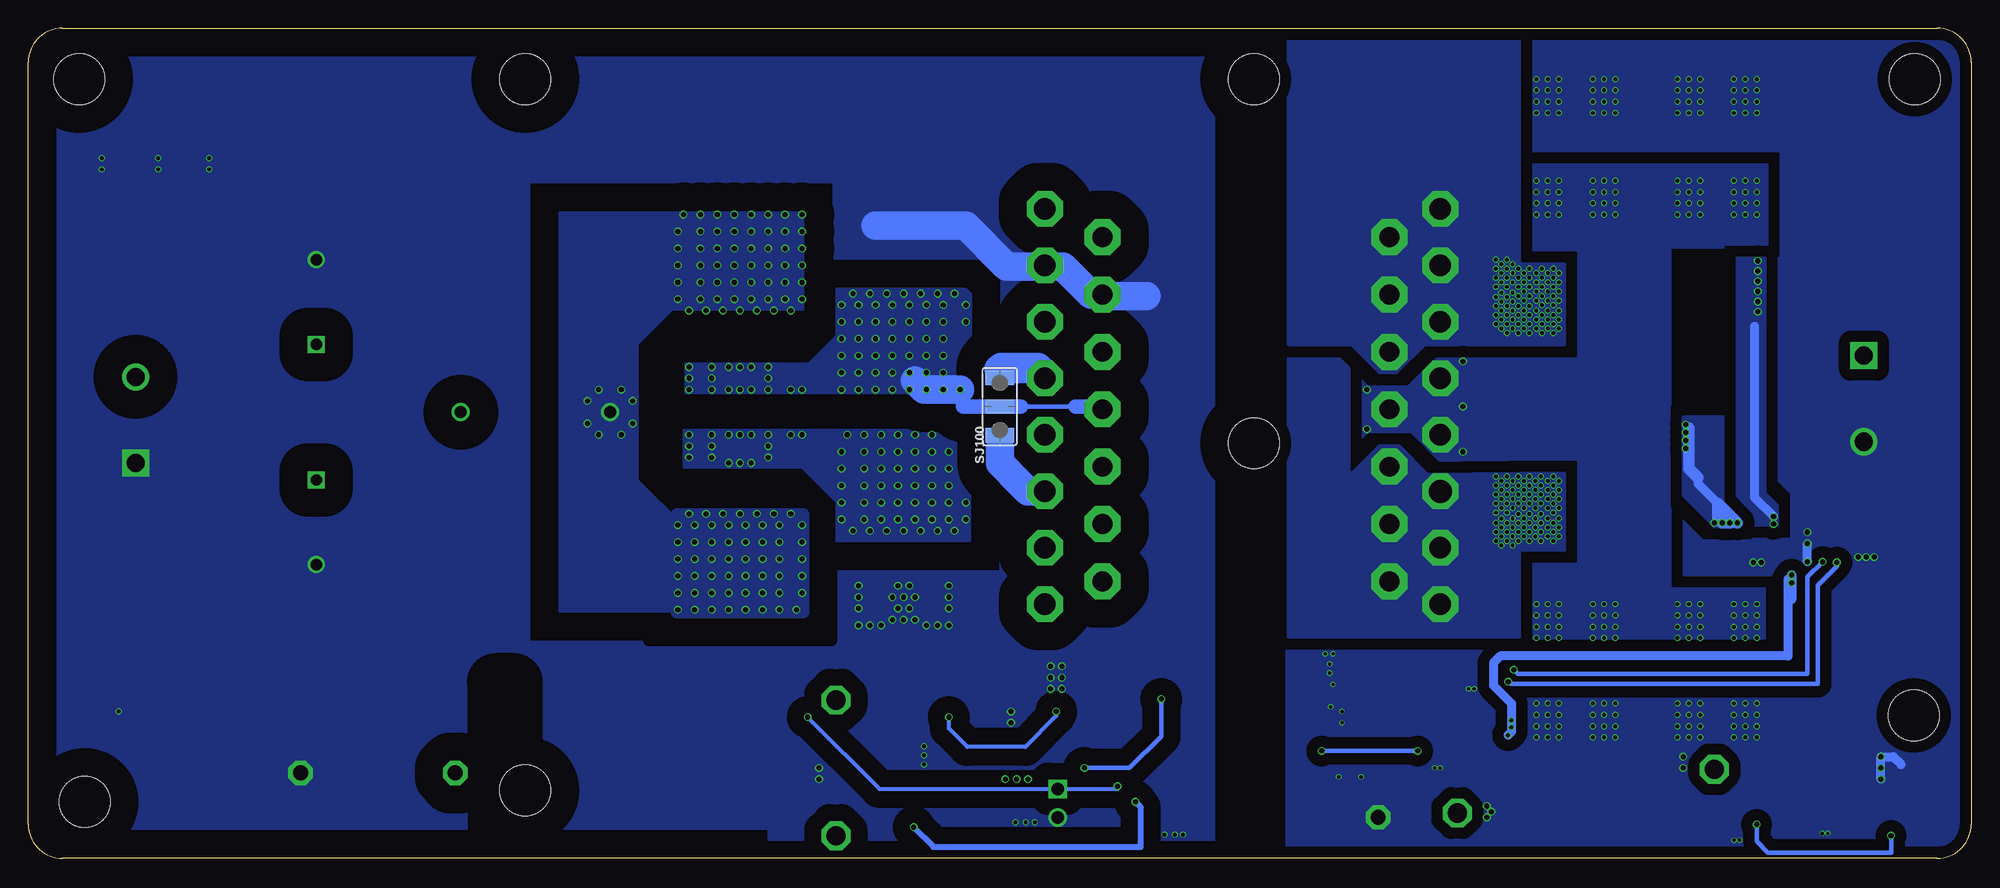
[diagram p5: board, bottom side, seen from below]

Size 172 x 73.5 mm. Coordinates in mm from the lower left corner, seen from the top.
Outline: 3,0 169,0 arc90 172,3 172,70.5 arc90 169,73.5 3,73.5 arc90 0,70.5 0,3 arc90 3,0
Copper layers (1*16): Top 0.035559375mm / dielectric 1.6mm / Bottom 0.035559375mm
Design rules "jlcpcb2layer *": minimum track width 5mil, minimum drill 12mil, track to track 5mil, track to pad 5mil, pad to pad 5mil, via to via 5mil, smd to smd 5mil, copper to edge 8mil, drill to drill 6mil, minimum pad ring 5mil, minimum via ring 3mil, stop-mask expansion 2.5mil, vias tented up to drill 30mil, thermal gap 10mil
Holes 4.5 mm at 63.5,69 5,69 128,69 167.5,69 167,5 128,6 63.5,36.75 5.1,12.65
tRestrict: 5 lines
bRestrict: 3 lines

### Footprints (pad centres in the part's own frame; a part is rotated, then mirrored left to right if it is on the bottom)
CHIPLED_0805 = smd 1.2 x 1.2: A 0,-1.05; C 0,1.05
P1-17 = drill 1.702 pad 2.54 octagon: TP 0,0
16SVF1000M = smd 1.9 x 4.4: 1 0,-4.35; 2 0,4.35
C1206K = smd 1.5 x 2: 1 -1.5,0; 2 1.5,0
C1812 = smd 1.4 x 3.5: 1 -2.05,0; 2 2.05,0
CAPPRD750W80D1825H2700 = drill 1 pad 1.5 square: 1 0,0 | drill 1 pad 1.5: 2 7.5,0
C0805K = smd 1.3 x 1.6: 1 -1,0; 2 1,0
C0603K = smd 1.05 x 1.08: 1 -0.875,0; 2 0.875,0
C0402K = smd 0.925 x 0.74: 1 -0.6,0; 2 0.6,0
C0402 = smd 0.7 x 0.9: 1 -0.65,0; 2 0.65,0
STB20N95K5 = smd 1.6 x 3.5: 1 -2.54,-6.907; 3 2.54,-6.907 | smd 12.2 x 9.75: 2 0,3.368
DIOM5127X229N = smd 2.2 x 1.55: 1 -2.05,0; 2 2.05,0
SOD3716X145N = smd 1.2 x 0.75: 1 -1.7,0; 2 1.7,0
DIOM5226X290N = smd 2.392 x 1.565: 1 -2.108,0; 2 2.108,0
TP13R = smd 1.3 x 1.3: TP 0,0
P1-13 = drill 1.321 pad 2.159 octagon: TP 0,0
SOIC127P600X175-8N = smd 1.5 x 0.65: 1 -2.7,1.905; 2 -2.7,0.635; 3 -2.7,-0.635; 4 -2.7,-1.905; 5 2.7,-1.905; 6 2.7,-0.635; 7 2.7,0.635; 8 2.7,1.905
SOT95P280X100-6N = smd 1.05 x 0.55: 1 -1.3,0.95; 2 -1.3,0; 3 -1.3,-0.95; 4 1.3,-0.95; 5 1.3,0; 6 1.3,0.95
SOT95P237X112-3N = smd 1.3 x 0.6: 1 -1.05,0.95; 2 -1.05,-0.95; 3 1.05,0
TB00576202BE = drill 1.6 pad 2.4 square: 1 0,0 | drill 1.6 pad 2.4: 2 7.62,0
61300211121 = drill 1.1 square: 1 -1.27,0 | drill 1.1: 2 1.27,0
2300LL102VRC = drill 1.06 pad 1.59: 1 0,0; 2 13.208,0
LQH5BPB100MT0L = smd 1.85 x 4.1: 1 -1.825,0; 2 1.825,0
SOP254P1015X230-4N = smd 1.85 x 0.7: 1 -4.7,1.27; 2 -4.7,-1.27; 3 4.7,-1.27; 4 4.7,1.27
NXE2S1205MCR13 = smd 1 x 2.3: 1 -3.81,-4.7; 3 -1.27,-4.7; 7 3.81,-4.7; 8 3.81,4.7; 14 -3.81,4.7
D2PAK = smd 1.257 x 3.429: 1 -2.54,-8.192; 3 2.54,-8.192 | smd 10.668 x 9.017: 2 0,1.715
R0805 = smd 1.3 x 1.5: 1 -0.95,0; 2 0.95,0
R0402 = smd 0.6 x 0.7: 1 -0.5,0; 2 0.5,0
R2512 = smd 1.8 x 3.2: 1 -2.8,0; 2 2.8,0
R0603 = smd 1 x 1.1: 1 -0.85,0; 2 0.85,0
R1206 = smd 1.6 x 1.803: 1 -1.422,0; 2 1.422,0
SJ_2W = smd 1.27 x 2.54: 1 -2.54,0; 2 0,0; 3 2.54,0
BIGTRANS! = drill 1.905 pad 3.175 octagon: 1 0,0; 2 0,5; 4 0,15; 5 0,20; 6 0,25; 7 0,30; 8 0,35; 9 35,0; 10 35,5; 11 35,10; 12 35,15; 13 35,20; 14 35,25; 15 35,30; 16 35,35 | drill 2.032 pad 3.175 octagon: 3 0,10
B66362B1014T001 = drill 1.75 pad 3.175 octagon: 1 0,0; 2 0,25.4; 3 5.08,0; 4 5.08,25.4; 5 10.16,0; 6 10.16,25.4; 7 15.24,0; 8 15.24,25.4; 9 20.32,0; 10 20.32,25.4; 11 25.4,0; 12 25.4,25.4; 13 30.48,0; 14 30.48,25.4
DPACK = smd 1.6 x 3: 1 -2.28,-4.8; 3 2.28,-4.8 | smd 5.8 x 6.2: 4 0,2.38
SOT95P240X120-3N = smd 0.85 x 0.6: 1 -1.2,0.95; 2 -1.2,-0.95; 3 1.2,0
DIOM5226X220N = smd 2.3 x 1.55: 1 -2.15,0; 2 2.15,0

### Placement (x,y rotation side)
5VLED  92.5,1.5 90 top
13.75V  41,2 180 top
13.75V_TP  45.5,4 270 top
AUX5V_TP  100.5,2 0 top
AUXBUCK_TP  100.5,14 270 top
C1  22.5,63 0 top
C2  35,63 0 top
C3  45.5,63.5 180 top
C4  158.12,59.62 90 top
C5  163.38,59.62 90 top
C6  146.5,45.5 90 top
C7  146.5,33.5 270 top
C8  15.8,62.1 90 top
C9  14.05,24.75 180 top
C10  18,25 180 top
C11  19.5,42.5 90 top
C12  22.5,17 180 top
C13  35,17 180 top
C14  35.25,8.88 90 top
C15  46,9 0 top
C16  55,14.5 0 top
C17  73.1,9.6 90 top
C18  76.5,7.88 0 top
C19  81.5,12.12 0 top
C20  85.5,14.12 0 top
C21  90.12,8 0 top
C22  96,10 0 top
C23  96,8.75 0 top
C24  100.5,10 90 top
C25  6,3 90 top
C26  12.05,1.25 0 top
C27  13,4.5 90 top
C28  22.38,1.88 90 top
C29  24.12,1.88 90 top
C30  25.88,1.88 90 top
C31  43,6.75 90 top
C32  55,5.5 270 top
C33  72.5,3.12 90 top
C34  87.38,1.75 180 top
C35  100.5,6 270 top
C36  57.5,71.5 180 top
D1  94.5,49 180 top
D2  109,49.5 0 top
D3  94.5,30 0 top
D4  109,29.5 180 top
D5  10,8 180 top
D6  74.5,17 180 top
D7  83,17 180 top
D8  47,1 180 top
D9  52.5,1 180 top
D10  53,63.5 0 top
D11  58.5,65.5 270 top
GATE1_TP  25.5,52 0 top
GATE2_TP  26.5,38 90 top
GND_TP1  52.5,3.62 0 top
HVLED  164,15 180 top
HVOUT_TP  134.2,7.55 270 top
IC1  16,29 0 top
IC2  46,12.5 180 top
IC3  84.88,11.62 0 top
IC4  10.5,4 270 top
IC5  76.5,4 270 top
INPUT  9.5,44.5 270 top
J1  162.5,35 90 top
J2  80.88,4.88 270 top
L1  120.5,39.5 0 top
L2  92,14.25 90 top
L3  17.5,5.75 0 top
MAINBUCK_TP  22.75,7.88 180 top
OPT1  63.5,16.38 180 top
PS1  63.38,7 0 top
PWRGND_TP  147.9,7.55 0 top
Q1  34.88,47.12 270 top
Q2  34.88,33.12 270 top
R2  21.5,52.6 0 top
R3  21.5,49.6 0 top
R4  11.62,30.82 270 top
R5  19.56,38.62 0 top
R6  19.56,34 0 top
R7  20.8,27.7 90 top
R8  22.8,27.7 90 top
R9  27.5,8 0 top
R10  30.5,8 0 top
R11  44,17 180 top
R12  49,7.5 90 top
R13  53.5,12.5 0 top
R14  55,16.5 0 top
R15  71.4,11.4 270 top
R16  75.88,11.25 270 top
R17  77.88,11.25 270 top
R18  81.5,10.62 0 top
R19  82.12,13.62 90 top
R20  87.5,10.88 270 top
R21  105,7.1 90 top
R22  106,11 0 top
R23  112.5,12 180 top
R24  118.5,12 180 top
R25  124.5,12 180 top
R26  133,12 180 top
R27  138.5,12 180 top
R28  144,12 180 top
R29  149.5,12 180 top
R30  155,12 180 top
R31  7.1,5.2 90 top
R32  7.1,3.1 270 top
R33  8.18,3.1 270 top
R34  43,1.7 270 top
R35  72.5,6.5 90 top
R36  91.5,4.5 270 top
R37  46,67 180 top
R38  53,69 90 top
SJ100  86,40 90 bottom
T1  47,22.5 0 top
T1.1  51.5,55 270 top
U$1  HV  [PSFBC_ELECTRIC_SHOCK]  94.16,66 0 top
U$2  HV  [PSFBC_ELECTRIC_SHOCK]  164.9,53.86 90 top
U$3  155.1,20.85 90 top
U$4  157.43,7.5 0 top
VR1  33.75,3.62 270 top
VR2  98,6 90 top
Z3  86.75,4.5 180 top

### Tracks (layer width: path | path; a pad name or v marks a point on that pad's centre or on a via)
AUX1
  Top 0.813: D6.2 72.45,20.7 70.7,22.45 70.7,53 72.7,55 T1.1.2
  Top 2.54: 79.4,57.5 T1.16
  Top 3: T1.1.2 79.4,57.5
AUXB  (via drill 0.45)
  Top 0.4: VR2.3 96.88,8.32 C23.2 96.88,9.78 C22.2 97.53,10.88 C24.2
  Top 0.55: L2.1 93.08,12.43 93.35,12.15
  Top 0.6: C19.1 80.9,10.72 R18.1 | 93.35,12.15 96,12.15 96.65,11.5 C22.2 | C24.2 AUXBUCK_TP.TP
  Top 0.7: C19.1 80.9,12.9 v81,13 | L2.1 90.58,12.43 v90.5,12.5
  Bottom 0.35: v81,13 81,12.6 83.73,9.86 88.86,9.86 90.5,11.5 v90.5,12.5
AUXD
  Top 0.6: R20.1 87.25,11.62 IC3.5
  Top 1: R16.2 R17.2 79.01,9.83 80.24,8.6 85.94,8.6 88.9,5.64 Z3.1
  pour Top (isolate 0.254, rank 3, no thermals): 88,6 88,1 89.5,1 89.5,10 87.5,12 86,12 86,10 86.5,9.5 86.5,7.5
BRIDGEGND
  Top 0.61: R11.2 43.02,17 41.12,18.9 41.12,24.5 40.73,24.9 28.28,24.9 26.68,26.5 Q2.3
  pour Top (isolate 1.016, rank 3, no thermals): 29.1,47.5 21.12,47.5 21.12,29.5 29.1,29.5
BS1
  Top 0.406: IC4.1 11.53,5.38
  Top 0.61: 11.53,5.38 C27.2
BS2
  Top 0.6: IC3.1 83.58,13.07 C20.1
CS-IN
  Top 0.7: R11.1 44.85,16.15 47.87,13.13 IC2.3 50.63,13.13 52,14.5 C16.1
DC+
  Top 0.4: HVOUT_TP.TP 131.58,10.17 R26.2 131.5,12 | 131.5,12 131.5,16 | R25.1 131.5,12
  Top 0.406: 131.5,16 131.5,24
  pour Top (isolate 2.5, rank 2, no thermals): 174,58 130.5,58 130.5,16.5 174,16.5
DRAIN1  (via drill 0.35)
  other vias: 40.6,52.6 40.6,51.8 40.6,51 41.6,52.6 41.6,51.8 41.6,51 42.1,49.7 42.1,48.9 42.1,48.1 42.1,47.3 41.1,49.7 41.1,48.9 41.1,48.1 41.1,47.3 41.6,50.1 41.6,49.3 41.6,48.5 41.6,47.7 40.6,50.1 40.6,49.3 40.6,48.5 40.6,47.7 42.1,53 42.1,52.2 42.1,51.4 42.1,50.6 41.1,53 41.1,52.2 41.1,51.4 41.1,50.6 41.1,46.5 41.6,46.9 40.6,46.9 39.1,52.2 39.1,51.4 39.1,50.6 39.1,49.8 40.1,52.2 40.1,51.4 40.1,50.6 40.1,49.8 39.6,48.5 39.6,47.7 39.6,46.9 40.1,48.9 40.1,48.1 40.1,47.3 40.1,46.5 39.1,48.9 39.1,48.1 39.1,47.3 39.1,46.5 39.6,51.8 39.6,51 39.6,50.2 39.6,49.4 37.5,51.8 37.5,51 37.5,50.2 37.5,49.4 38.5,51.8 38.5,51 38.5,50.2 38.5,49.4 38,48.1 38,47.3 38,46.5 38.5,48.5 38.5,47.7 38.5,46.9 38,52.2 37.5,48.5 37.5,47.7 37.5,46.9 38,51.4 38,50.6 38,49.8 38,49 37,52.2 36.5,51.8 36.5,51 36.5,50.2 36.5,49.4 37,48.1 37,47.3 37,46.5 36.5,48.5 36.5,47.7 36.5,46.9 37,51.4 37,50.6 37,49.8 37,49
  pour Top (isolate 1.016, rank 2, no thermals): 56.4,64.97 43,64.97 43,55.63 30.5,55.63 30.5,40.84 43.5,40.84 43.5,45.5 48.25,45.5 50.75,43 52.5,43 55,45.5 56.4,45.5
  pour Bottom (isolate 1.016, rank 2, no thermals): 40,74.7 60.45,74.7 60.45,45.5 54.88,45.5 52.38,43 50.88,43 48.38,45.5 36,45.5 36,52.6 40,52.6
DRAIN2  (via drill 0.35)
  Top 1.016: 51.6,29.5 T1.1.11
  Top 3: 51.6,29.5 55.25,29.5 59.2,33.45 59.2,64.5
  other vias: 42.1,33.8 40.6,33.4 40.6,32.6 40.6,31.8 40.6,31 41.6,33.4 41.6,32.6 41.6,31.8 41.6,31 42.1,29.7 42.1,28.9 42.1,28.1 41.1,29.7 41.1,28.9 41.1,28.1 41.6,30.1 41.6,29.3 41.6,28.5 41.6,27.7 40.6,30.1 40.6,29.3 40.6,28.5 40.6,27.7 42.1,33 42.1,32.2 42.1,31.4 42.1,30.6 41.1,33 41.1,32.2 41.1,31.4 41.1,30.6 38.1,33.8 38.1,33 38.1,32.2 38.1,31.4 39.1,33.8 39.1,33 39.1,32.2 39.1,31.4 39.6,30.1 39.6,29.3 39.6,28.5 38.6,30.1 38.6,29.3 38.6,28.5 39.1,30.5 39.1,29.7 39.1,28.9 39.1,28.1 38.1,30.5 38.1,29.7 38.1,28.9 38.1,28.1 39.6,33.4 39.6,32.6 39.6,31.8 39.6,31 38.6,33.4 38.6,32.6 38.6,31.8 38.6,31 40.1,33.8 40.1,33 40.1,32.2 40.1,31.4 40.1,30.5 40.1,29.7 40.1,28.9 40.1,28.1 36.5,33.4 36.5,32.6 36.5,31.8 36.5,31 37.5,33.4 37.5,32.6 37.5,31.8 37.5,31 37,29.7 37,28.9 37,28.1 37.5,30.1 37.5,29.3 37.5,28.5 37,33.8 36.5,30.1 36.5,29.3 36.5,28.5 41.1,33.8 37,33 37,32.2 37,31.4 37,30.6
  pour Top (isolate 1.016, rank 3, no thermals): 43.5,39.4 30.64,39.4 30.64,26.1 42.63,26.1 42.63,19.5 60.56,19.5 60.56,66 56.5,66 56.5,45 55.1,45 55.1,34.3 54.7,34.3 52.5,36.5 50.5,36.5 48.25,34.25 43.5,34.3
  pour Bottom (isolate 1.016, rank 3, no thermals): 36,34.1 48.12,34 50.62,36.5 52.38,36.5 54.77,34.1 55.1,34.1 55.1,44.9 60.45,44.9 60.45,19.6 40,19.6 40,27.3 36,27.3
EN1
  Top 0.406: IC4.4 9.45,2.6 R33.2
EN2
  Top 0.6: IC3.4 86.47,10.38 R20.2
FB1
  Top 0.406: C25.2 R32.1 R31.1 9.55,4.7 IC4.3
FB2
  Top 0.6: IC3.3 82.05,10.68 R18.2 82,12.03 C19.2 82.12,12.15 R19.1
GNDA  (via drill 0.3, 0.35, 0.45)
  Top 0.127: 22.5,67.65 23.35,67.65 23.5,67.5 | 35,67.65 35.85,67.65 36,67.5 | 22.5,12.75 23.35,12.75 23.5,12.6 | 35,12.75 35.85,12.75 36,12.6
  Top 0.4: 8.6,8 D5.2 | R31.2 7.1,6.1 v8,7 | C9.2 13.18,24.93
  Top 0.406: R34.1 43,3.94 43.5,4.15 43.5,5.25 C31.1 43,3.62 v42.88,3.62 | 55,11 54.88,10.88 | 14.46,28.36 14.5,28.4 | 13.2,1.52 C26.2 12.7,1.48 | C15.2 46.88,11.62 44.5,14 v44.5,15 | IC2.5 43.9,15 v44,15 v44.5,15 | v44.5,15 44.09,14.6 44.09,14.4 | C15.2 46.88,8.12 v47,8 | C15.2 46.88,8.62 v47.5,8 | C30.1 C29.1 C28.1
  Top 0.6: C26.2 13.17,1 | 22.25,1 C28.1 | PS1.1 59.56,4.93 58.12,6.38 C32.1 | 13.18,24.93 v14.5,26.25
  Top 0.61: IC4.2 10.5,6.1 8.6,8 | v14.5,27.88 14.5,28.4 v14.5,28.88 | IC1.3 14.46,28.36 | v13.2,2.2 13.2,1.52 | v12.7,2.2 12.7,1.48 | v20.5,1.6 20.5,1 | v21,1.6 21,1
  Top 0.7: 45.5,13 44.5,14 44.09,14.4 IC2.5
  Top 0.8: C11.1 19.5,41.36 R5.1
  Top 0.813: 13.17,1 20.5,1 21,1 22.25,1 | R9.1 v25.5,8
  Bottom 0.813: v14.5,26.25 v14.5,27.88 | v8,7 v8,9 6.9,9 6.2,8.3
  other vias: 8,8 42.48,4.12 42.88,4.62 18.6,26.2 19.3,26.2 25.5,9 10,26.68 9.3,26.68 8.6,26.68 26,66 24,66 24,67 24,68 24,69 21,69 21,68 21,67 21,66 20,66 20,67 20,68 20,69 19,69 19,68 19,67 19,66 25,66 25,67 25,68 25,69 26,69 26,68 26,67 38.5,66 36.5,66 36.5,67 36.5,68 36.5,69 33.5,69 33.5,68 33.5,67 33.5,66 32.5,66 32.5,67 32.5,68 32.5,69 31.5,69 31.5,68 31.5,67 31.5,66 37.5,66 37.5,67 37.5,68 37.5,69 38.5,69 38.5,68 38.5,67 26,10.7 24,10.7 24,11.7 24,12.7 24,13.7 21,13.7 21,12.7 21,11.7 21,10.7 20,10.7 20,11.7 20,12.7 20,13.7 19,13.7 19,12.7 19,11.7 19,10.7 25,10.7 25,11.7 25,12.7 25,13.7 26,13.7 26,12.7 26,11.7 38.5,10.7 36.5,10.7 36.5,11.7 36.5,12.7 36.5,13.7 33.5,13.7 33.5,12.7 33.5,11.7 33.5,10.7 32.5,10.7 32.5,11.7 32.5,12.7 32.5,13.7 31.5,13.7 31.5,12.7 31.5,11.7 31.5,10.7 37.5,10.7 37.5,11.7 37.5,12.7 37.5,13.7 38.5,13.7 38.5,12.7 38.5,11.7 55.7,13 55.7,12 54,7.2 56,7.2 56.7,13.4 56.5,15.4 56.8,16.4 56.8,17.2 57.2,18.1 56.5,18.1
  pour Bottom (isolate 1.016, rank 6, no thermals): -20,74.05 44.5,74.05 44.5,19.2 60.7,19.2 60.7,-2.5 -20,-2.5
  pour Top (isolate 1.016, rank 6, no thermals): 41.5,73.5 -3.5,73.5 -3.5,62.5 41.5,62.5
  pour Top (isolate 1.016, rank 6, no thermals): 59.87,9.5 59.87,19.5 43.5,19.5 43.5,14.5 53.5,14.5 53.5,17 55,17 55,14 54.5,13.5 54,13.5 53.5,13 53.5,11.5 54,11 54,10 54.5,9.5
  pour Top (isolate 1.016, rank 6, no thermals): 9,9.5 -3.5,9.5 -3.5,2 -1.5,0 4.5,0 6,1.5 6,5.5 7,6.5 8,6.5 9,7.5
  pour Top (isolate 1.016, no thermals): 7,6 9.5,6 10,5.5 10,5 10.75,5 10.75,6.25 10,7 10,9 9.5,9.5 7,9.5 6.5,9 6.5,6.5
  pour Top (isolate 1.016, rank 6, no thermals): 59.99,-0.5 59.99,19.5 54,19.5 54,17 55,17 55,14 54.5,13.5 54,13.5 47.5,7 47.5,-0.5
  pour Top (no thermals): 43.5,6.5 42.5,6.5 42.5,2.5 43.5,2.5
  pour Top (isolate 1.016, no thermals): 47.5,15 44.5,15 44.5,10 46.5,10 46.5,8.5 47.5,8.5
  pour Top (isolate 1.016, no thermals): 18,40.5 8,40.5 8,25 11.5,25 11.5,32.5 18,32.5
  pour Top (isolate 1.016, no thermals): 39.9,17.9 -3.42,17.9 -3.42,8 10,8 10,10 25,10 25,8 27,8 27,9.3 39.9,9.3
  pour Top (no thermals): 19.5,26.35 18.4,26.35 18.4,24.43 19.5,24.43
N$1
  Top 0.61: R25.2 R24.1
N$2  (via drill 0.45)
  Top 0.4: IC2.7 41.73,11.87 41.73,12.62 41.17,13.18 41.17,15.46 v41,15.64 | IC1.2 12.6,29.64 11.9,28.93 v11.9,26.2
  Bottom 0.4: v11.9,26.2 11.9,25.86 13.57,24.18 13.57,15.44 40.8,15.44 v41,15.64
N$3  (via drill 0.45)
  Top 0.35: C18.1 74.62,7.88 73.78,8.72 C17.1
  Top 0.4: 75.55,7.8 C18.1 75.62,6.62 75.62,6.33 | IC5.2 75.55,6.38 v75.58,6.38 | R22.2 106.95,12.05 106.1,12.9 103.4,12.9 v103,12.5
  Top 0.61: R23.2 108.45,12 107.45,11
  Top 0.7: v75.58,6.38 75.62,6.33 | 75.62,6.62 75.55,6.55 | 107.45,11 R22.2
  Bottom 0.35: v75.58,6.38 75.58,6.14 J2.1 96.64,6.14 v103,12.5
N$4
  Top 0.6: D9.2 D8.1
N$5  (via drill 0.45)
  Top 0.3: IC2.6 43.23,13.2 42.92,13.2
  Top 0.4: v13.15,26.25 13.15,26.95 IC1.4 | IC2.6 42.37,13.13 42,13.5 42,16 41.3,16.7 v40.5,16.7
  Bottom 0.4: v40.5,16.7 40.15,16.35 14.5,16.35 14.5,24.9 v13.15,26.25
N$6
  Top 0.254: IC1.8 18.5,31.11 13.5,31.11 IC1.1 12.9,31.3 11.65,31.3
  Top 0.3: R4.1 11.65,31.3
N$7  (via drill 0.45)
  Top 0.813: R2.1 R3.1 20.1,50.05 20.05,50.05 | IC1.7 17.51,29.64 v17.51,30.24 v17.5,30.25
  Bottom 0.813: 19.2,47.1 19.2,31.95 v17.5,30.25
  other vias: 18.9,51.1 18.9,48.4 17.5,29.6 18.9,49.3 18.9,52.9 18.9,50.2 18.9,52
  pour Bottom (isolate 1.016): 18.2,53.25 18.2,32.4 17.1,31.3 17.1,29.38 19.73,29.38 19.7,30.2 19.7,30.9 20.8,32 20.8,53.25
  pour Top (no thermals): 20.75,48 18.5,48 18.5,53.3 20.75,53.3
N$8
  Top 0.61: IC1.5 20.8,27.09 | 20.8,27.09 R7.1 | R8.1 22.8,27.09 20.8,27.09
N$9
  Bottom 0.8: 85.05,34.05 85.15,34.15 | 86,36.3 SJ100.1
  Bottom 2.54: T1.11 83.5,32.5 85.05,34.05 | 85.15,34.15 86,35 86,36.3
N$10
  Top 0.813: R9.2 29,8 | 29,8 R10.1 | VR1.1 29,5.91 29,8
N$11
  Top 0.6: D9.1 55,1.8 C32.2 55,3.5 58,0.5 61,0.5 62.1,1.61 PS1.3
N$12
  Top 0.61: R30.1 157.92,12 161.97,16.05 HVLED.A
N$13
  Top 0.406: IC2.2 52.02,11.87 R13.1
N$14
  Top 0.61: R29.1 R30.2
N$15
  Top 0.61: R24.2 R23.1
N$16
  Top 0.4: 104.96,10.61 R22.1 105,10.95 R21.2
N$17
  Top 0.61: R28.1 R29.2
N$18  (via drill 0.45)
  Top 0.35: R15.1 71,12.65 71,14.75 68.2,17.55 OPT1.2 68.2,17.6 v71.7,14.1
  Top 0.4: 77.45,7.8 C18.2
  Top 0.7: IC5.1 77.45,7.8 | v78.5,8 78.38,7.88 C18.2
  Bottom 0.4: v78.5,8 74.5,8 71.7,10.8 v71.7,14.1
N$19
  Top 0.35: OPT1.1 69.2,14.11 69.2,10.3 72.15,7.35 R35.2
N$20
  Top 1.5: 50,63.42 47.08,63.42 C3.1 49.5,63.5 | D10.1 49.5,63.5 | 49.5,63.5 48.8,64.2 R37.1
N$21
  Top 0.5: C17.2 71.47,10.47 R15.2
N$22
  Top 0.406: 13.75V.C 43,0.95 R34.2
N$23
  Top 1.5: D11.1 58.5,68.05 58.47,68.08 | D11.1 59,68.11 C36.1 | R38.1 57.09,66.2 D11.1
N$24
  Top 0.61: R27.1 R28.2
N$25
  Bottom 0.8: SJ100.3 85.96,42.5 T1.13
  Bottom 2.54: T1.13 82,42.9 82.6,43.5 84.9,43.5 | 84.9,43.5 85,43.4 | 84.9,43.5 85.9,43.5 86.1,43.3
N$26
  Top 0.4: R36.2 91.5,3.27 91.4,3.25 91.4,1.55
  Top 0.8: 5VLED.C 91.4,1.55
N$27
  Top 1: R17.1 R16.1 76.45,12.67 D6.1
N$28
  Top 0.61: R26.1 R27.2
OPTO-EMITT  (via drill 0.45)
  Top 0.7: IC2.1 49,10.6 v49,9.5 R12.2 | OPT1.4 60.66,15.11 61.3,14.47 61.3,10.13 60.66,9.5 v57.5,9.5
  Bottom 0.406: v57.5,9.5 v49,9.5
PRE  (via drill 0.45)
  Top 0.4: R32.2 v7.1,2 | v19,3 19.32,3.33 L3.2
  Top 0.406: R32.2 6.2,2.6 C25.1
  Top 0.813: VR1.3 28.95,3 29.5,3 29.5,2.88 C30.2
  Bottom 0.4: v7.1,2 7.1,0.5 18,0.5 19,1.5 v19,3
  pour Top (isolate 1.016, rank 3, no thermals): 18.5,2.5 27.5,2.5 27.5,0 30.25,0 30.25,6.87 28.14,6.87 25.25,9.75 18.5,9.75
PWRGND  (via drill 0.35, 0.45)
  Top 0.152: HVLED.C v164,13
  Top 0.4: HVLED.C 164,13.45 | R21.1 102.85,6.15 v102,7
  Top 0.55: 72.62,2.12 C33.1 | 81.5,1.95 81.5,2.98 81.24,3.24 J2.2
  Top 0.6: IC3.2 84.62,11.62 v85,12 | PS1.7 67.36,2.12
  Top 0.61: VR2.1 98.35,6.1 98.7,6.1 99.15,6.55 100.17,6.55 C35.1 | C33.1 72.38,2.12
  Top 0.7: v85,12 v85,13
  Top 0.813: C4.2 C5.2 | C5.2 163.82,61.67 164,61.5 163.55,61.5 C5.2 | C4.2 156.32,61.67 | 156.32,61.67 v156,62 | C4.2 158.45,62 v160.5,62 | v160.5,62 v165.5,62 v165.5,61 | C4.2 164.82,61.67 v165.5,61 | v165.5,61 v156,61 | v156,61 156,61.35 156.32,61.67 | v156,61 v156,62 | v156,62 v160.5,62 | C33.1 76.5,2.25 | 76.5,2.25 79.9,2.25 80.25,2.25 81.24,3.24 | IC5.3 76.5,2.25 | VR2.1 97.05,5.35 95.4,7 95.3,7 95.12,7.17 C23.1
  Top 1.27: PS1.7 72.45,2.3 C33.1 79.9,2.25 | v71.4,2.1 71.42,2.12 72.62,2.12
  Top 2.54: T1.1.4 77.92,49.92 80.5,52.5 T1.15 84.9,52.5 88.4,56 91.87,56 D1.3 D1.1
  Bottom 2.54: 97,56 89,56 85.4,52.4 80.4,52.4 77.92,49.92 T1.1.4 76.78,49.8 73,49.8
  other vias: 81.5,15 80.5,15 81.5,17 80.5,16 84.5,7 85.5,7 80.5,17 81.5,16 83.5,7 93.5,23.12 94.5,23.12 95.5,23.12 95,24.12 94,24.12 94,22.12 95,22.12 90.5,22.12 90.5,23.12 90.5,24.12 98.5,24.12 98.5,23.12 98.5,22.12 95.5,21.12 93.5,21.12 94.5,21.12 91.5,20.62 92.5,20.62 96.5,20.62 97.5,20.62 90.5,20.62 98.5,20.62 102,8 160.5,61 92.7,9.9 92.7,9.1 92.7,8.3 82.9,3.2 83.7,3.2 84.6,3.2 70.5,2.1 69.8,2.1
  pour Bottom (isolate 2.5, rank 6, no thermals): 185,75.5 67,75.5 67,-4.5 182,-4.5 186,-0.5 186,74.5
  pour Top (isolate 0.406, rank 5, no thermals): 86,7.5 82,7.5 82,7 81.5,6.5 80,6.5 79.5,6 79.5,1 87,1 87,6.5
  pour Top (no thermals): 95.5,10.5 91,10.5 90.62,10.12 90.62,5.38 91.1,4.9 97,4.9 97,6 95.5,7.5
  pour Top (no thermals): 90.14,20 98.86,20 98.86,25 90.14,25
  pour Bottom (isolate 1.5, no thermals): 106.5,18 67,18 67,1 106.5,1
  pour Top (no thermals): 80,14 82.5,14 82.5,17.5 80,17.5
  pour Top (no thermals): 102.5,9.5 100,9.5 100,6.5 102.5,6.5
  pour Top (no thermals): 98.86,58.4 90.14,58.4 90.14,53.4 98.86,53.4
Q1G
  Top 0.61: Q1.1 27.5,49.66
  Top 0.813: R3.2 R2.2
  pour Top (no thermals): 28.5,53.5 22,53.5 22,48.5 28.5,48.5
Q2G  (via drill 0.45)
  Top 0.61: v22.05,29.7 22.35,29.4 22.35,29.1 R8.2 R7.2 21.38,29.23 v21.38,29.7
  Top 1.016: Q2.1 26.58,35.77 26.58,37.92 GATE2_TP.TP | GATE2_TP.TP 26.2,37.7 v25.27,37.7 | v25.27,38.4 25.68,38 26.27,38 | GATE2_TP.TP 26.27,38 | 26.27,38 v25.27,37 25.27,35.66 Q2.1 | Q2.1 26,35.66 26,36.7
  Bottom 0.813: 22.05,29.8 21.95,29.7 v20.7,29.7 24.2,33.2 24.2,33.7
  Bottom 1.016: 22.05,29.8 v22.05,29.7 | v22.05,29.7 v21.38,29.7 | v22.05,29.7 22.44,30.09 22.44,31.44 v20.7,29.7 | 25,38.1 25,34.5 24.2,33.7
  other vias: 25.27,36.3 22.75,29.7
  pour Top (no thermals): 23.3,29.85 20.3,29.85 20.3,29 23.3,29
  pour Bottom (isolate 1.016, rank 2, no thermals): 25.4,39 21.4,39 21.4,35 20.43,34.03 20.43,29.45 22.65,29.45 25.4,32.2
  pour Top (no thermals): 24.9,35.1 28.3,35.1 28.3,39 24.9,39
RECT  (via drill 0.45)
  other vias: 110,25 110,23.5 108.5,23.5 108.5,25 105.5,29.5 105.5,26.5 105.5,28 107,26.5 108.5,26.5 108.5,28 108.5,29.5 107,28 107,29.5 110,29.5 110,26.5 110,28 111.5,26.5 111.5,28 111.5,29.5 105.5,23.5 105.5,25 103.5,28 103.5,26.5 103.5,25 104.5,30.5 106,30.5 107.5,30.5 109,30.5 110.5,30.5 112,30.5 113.5,30.5 113,29.5 114.5,29.5 114.5,28 114.5,26.5 114.5,25 114.5,23.5 114.5,22 113,22 111.5,22 110,22 108.5,22 107,22 105.5,22 104,22 113,28 113,25 111.5,25 111.5,23.5 113,23.5 107,23.5 107,25 103.5,23.5 103.5,29.5 113,26.5 108,54 108,55.5 109.5,55.5 109.5,54 112.5,49.5 112.5,52.5 112.5,51 111,52.5 109.5,52.5 109.5,51 109.5,49.5 111,51 111,49.5 108,49.5 108,52.5 108,51 106.5,52.5 106.5,51 106.5,49.5 112.5,55.5 112.5,54 114.5,51 114.5,52.5 114.5,54 113.5,48.5 112,48.5 110.5,48.5 109,48.5 107.5,48.5 106,48.5 104.5,48.5 105,49.5 103.5,49.5 103.5,51 103.5,52.5 103.5,54 103.5,55.5 103.5,57 105,57 106.5,57 108,57 109.5,57 111,57 112.5,57 114,57 105,51 105,54 106.5,54 106.5,55.5 105,55.5 111,55.5 111,54 114.5,55.5 114.5,49.5 105,52.5 122.5,40.5 122.5,38.5 118.5,40.5 118.5,38.5 119.5,41.5 121.5,41.5 121.5,37.5 119.5,37.5
  pour Bottom (isolate 1.27, no thermals): 125,57.25 103.38,57.25 103.38,48.5 115,48.5 118,45.5 118,33.5 114,29.5 114,21.75 125,21.75
  pour Bottom (isolate 1.27, no thermals): 103.38,21.75 114.62,21.75 114.62,30.5 103.38,30.5
  pour Top (isolate 2.5, no thermals): 105.5,30.5 115,30.5 118,33.5 118,45.5 115,48.5 103.5,48.5 103.5,56.5 104.25,57.25 125,57.25 125,21.75 107.75,21.75 105.5,24
REG  (via drill 0.35, 0.45)
  Top 0.254: 11.7,30.25 15.2,30.25 16.2,29.25 16.2,28.2
  Top 0.3: R4.2 11.7,30.25 | 14.8,24.88 C9.1
  Top 0.406: R12.1 48.85,6.5 46.62,6.5 | 46.62,6.5 46.5,6.5 45.5,5.5 13.75V_TP.TP | 43,9 43.3,9 C15.1 45.12,8 | 45.12,8 45.12,7.62 45,7.5 44.75,7.75 C31.2 41.25,7.75 41,7.5 | 45.12,8 46.62,6.5
  Top 0.6: D8.2 45.3,4.8 13.75V_TP.TP
  Top 0.8: v15.9,25.1 15.9,27.9 16.2,28.2 16.36,28.36 IC1.6
  Top 0.813: R10.2 34.5,8 34.5,3.5 37,3.5 37,4 36.13,4 VR1.4 | 43.3,9 IC2.8 41.3,10.6 40.7,11.2 v40.7,11.6 v40.7,12.2 | 43,9 C31.2 | v15.9,24.4 15.9,25 C10.2 16.75,24.75 C9.1 15.28,25.1 v15.9,25.1 v15.9,24.4
  Bottom 0.813: v41,10.9 40.7,11.2 v40.7,11.6 40.7,13.7 42.3,15.3 42.3,17.3 41.7,17.9 16.2,17.9 16.2,23.2 | 16.2,23.2 15.9,22.9 v15.9,25.1 | v15.9,24.4 16.2,24.7 16.2,23.2
  pour Top (isolate 1.016, rank 3, no thermals): 44,10.87 42.12,10.88 42.12,19 38.5,19 38.5,10.87 37,10.87 37,8.25 32.5,8.25 32.5,0.5 42,0.5 42,8.5 44,8.5 44,2 47,2 47,7.5 45.5,7.5 45.5,9.5 44,9.5
REG5V  (via drill 0.45)
  Top 0.4: R35.1 72.5,4.8 C33.2
  Top 0.55: AUX5V_TP.TP 100.38,2 C35.2
  Top 0.6: 5VLED.A 93.62,1.57 v93.62,2.75 97.75,2.75 98.95,3.95 VR2.2 99.28,5.12 C35.2 | 71,5.65 70.85,5.65 67.19,9.31 PS1.8
  Top 0.61: v74,5 73.35,5.65 R35.1 71,5.65
  Top 1.27: 72.5,4.8 73.8,4.8 73,4 C33.2 70.85,5.65
  Bottom 0.55: v93.62,2.75 91.88,1 73.5,1 73.5,4.5 v74,5
RT
  Top 0.406: IC2.4 50.41,14.4 52,16 53.65,16 R14.1
SWITCH1
  Top 0.406: C27.1 14.38,3.62 14.5,3.5
  Top 0.61: IC4.6 11.75,3 12.38,3 C27.1
  pour Top (isolate 1.016, rank 3, no thermals): 17,2.25 17,9.5 10.88,9.5 10.88,6.5 13.5,6.5 14,6 14,4.5 12.75,3.25 11.25,3.25 11.25,2.25
SWITCH2
  pour Top (isolate 0.305, rank 2, no thermals): 86,12.5 86.5,12.5 87,13 88.5,13 89.5,14 94,14 94,17.5 86,17.5
TRANS1  (via drill 0.45)
  Bottom 0.4: SJ100.2 85.5,40 85,40 | 79.3,40 84.1,40
  Bottom 1: SJ100.2 87.5,40 | 89.25,41.5 v89.5,41.5
  Bottom 1.27: 89.25,41.5 89.25,40 87.5,40 85.5,40 | T1.1.8 77.14,40 79.3,40 | 84.1,40 85,40
  Bottom 2.54: v89.5,41.5 92.7,41.5 93.5,42.3
  other vias: 95.5,44.5 95.5,43 94,43 94,44.5 91,49 91,46 91,47.5 92.5,46 94,46 94,47.5 94,49 92.5,47.5 92.5,49 95.5,49 95.5,46 95.5,47.5 97,46 97,47.5 97,49 91,43 91,44.5 89,47.5 90,50 91.5,50 93,50 94.5,50 96,50 97.5,50 99,50 98.5,49 100,49 100,47.5 100,46 100,44.5 100,43 100,41.5 98.5,41.5 97,41.5 95.5,41.5 94,41.5 92.5,41.5 91,41.5 98.5,47.5 98.5,44.5 97,44.5 97,43 98.5,43 92.5,43 92.5,44.5 89,49 98.5,46 106.5,43.5 106.5,42.5 106.5,41.5 111.5,41.5 111.5,42.5 111.5,43.5 113.5,43.5 113.5,42.5 113.5,41.5 110,43.5 103.5,41.5 108,43.5 108,41.5 109,41.5 110,41.5 109,43.5 104.5,41.5
  pour Top (isolate 2.5, no thermals): 114,44 102.88,44 100.5,46.38 100.5,50.5 89,50.5 88.5,50 88.5,41 114,41
  pour Bottom (isolate 2.5, no thermals): 100.5,50.5 89,50.5 88.5,50 88.5,41.12 113.88,41.12 113.88,43.88 102.89,43.88 100.5,46.27
TRANS2  (via drill 0.45)
  Top 2.54: T1.1.14 79.52,21.9 83,21.9 89,27.9 v89,30
  Top 3: T1.1.14 78.92,22.5 T1.9
  other vias: 93.5,34.5 93.5,36 95,36 95,34.5 98,30 98,33 98,31.5 96.5,33 95,33 95,31.5 95,30 96.5,31.5 96.5,30 93.5,30 93.5,33 93.5,31.5 92,33 92,31.5 92,30 98,36 98,34.5 100,31.5 100,33 100,34.5 99,29 97.5,29 96,29 94.5,29 93,29 91.5,29 90,29 90.5,30 89,31.5 92,37.5 93.5,37.5 95,37.5 96.5,37.5 98,37.5 99.5,37.5 90.5,31.5 90.5,34.5 92,34.5 92,36 90.5,36 96.5,36 96.5,34.5 100,36 100,30 90.5,33 106.5,37.5 106.5,36.5 106.5,35.5 111.5,37.5 111.5,36.5 111.5,35.5 108,37.5 109,37.5 110,37.5 110,35 109,35 108,35 113.5,35.5 113.5,36.5 113.5,37.5 104.5,37.5 103.5,37.5
  pour Top (isolate 2.5, no thermals): 114,38 87,38 87,29 82.5,24.5 79.5,24.5 77.5,26.5 76.5,26.5 75.5,25.5 75.5,23.5 78,21 83,21 90,28 100.5,28 100.5,31.5 103.5,34.5 114,34.5
  pour Bottom (isolate 2.5, no thermals): 114,38 88.6,38 88.6,28 100.5,28 100.5,31.49 103.51,34.5 114,34.5
VCC28V  (via drill 0.35, 0.45)
  Top 0.127: C1.1 23.35,58.65 23.5,58.5 | C2.1 35.85,58.65 36,58.5 | 22.5,21.15 22.8,21.15 23.35,21.15 23.5,21 | 35,21.15 35.85,21.15 36,21
  Top 0.305: 22.5,22.8 22.4,22.7 22.4,21.55 22.8,21.15
  Top 0.406: R33.1 8.18,3.8 10.25,3.8 10.5,3.55 IC4.5 | C26.1 10.55,1.25 10.5,1.3 10.5,1.1 | 1.4,19.7 5.2,23.5
  Top 0.61: IC4.5 10.5,1.3 | 10.5,1.1 3.2,1.1 1.4,2.9 1.4,19.7
  Top 0.8: C11.2 9.5,43.5 INPUT.1
  Top 1.5: v37.5,59 39,60.5 42,60.5 44,62.5 C3.2 44,65.42
  other vias: 45,40 53.5,41.5 53.5,38 45,44 45,36 26,57 24,57 24,58 24,59 24,60 21,60 21,59 21,58 21,57 20,57 20,58 20,59 20,60 19,60 19,59 19,58 19,57 25,57 25,58 25,59 25,60 26,60 26,59 26,58 38.5,57 36.5,57 36.5,58 36.5,59 36.5,60 33.5,60 33.5,59 33.5,58 33.5,57 32.5,57 32.5,58 32.5,59 32.5,60 31.5,60 31.5,59 31.5,58 31.5,57 37.5,57 37.5,58 37.5,60 38.5,60 38.5,59 38.5,58 26,19.5 24,19.5 24,20.5 24,21.5 24,22.5 21,22.5 21,21.5 21,20.5 21,19.5 20,19.5 20,20.5 20,21.5 20,22.5 19,22.5 19,21.5 19,20.5 19,19.5 25,19.5 25,20.5 25,21.5 25,22.5 26,22.5 26,21.5 26,20.5 38.5,19.5 36.5,19.5 36.5,20.5 36.5,21.5 36.5,22.5 33.5,22.5 33.5,21.5 33.5,20.5 33.5,19.5 32.5,19.5 32.5,20.5 32.5,21.5 32.5,22.5 31.5,22.5 31.5,21.5 31.5,20.5 31.5,19.5 37.5,19.5 37.5,20.5 37.5,21.5 37.5,22.5 38.5,22.5 38.5,21.5 38.5,20.5
  pour Top (isolate 1.016, no thermals): 18.05,59 4.5,59 4.5,41.25 18.05,41.25
  pour Top (isolate 1.016, rank 3, no thermals): 41.5,56.5 7,56.5 7,23.5 22,23.5 22,19.38 -4,19.38 -4,61.5 41.5,61.5
  pour Top (isolate 1.016, rank 6, no thermals): 54,36.13 54,43.87 53.37,44.5 45.13,44.5 44.5,43.87 44.5,36.13 45.13,35.5 53.37,35.5
  pour Bottom (isolate 1.016, rank 5, no thermals): 54,45 39.1,45 39.1,61.5 26.6,61.5 26.6,24 18.25,24 18.25,19.2 39.1,19.2 39.1,34.9 54,34.9
  pour Top (isolate 1, no thermals): 40,23.5 -1.55,23.5 -1.55,19.1 40,19.1
  pour Bottom (isolate 1.016, rank 2, no thermals): 35,61.5 18,61.5 18,54 35,54
  pour Top (isolate 1.5, no thermals): 57.5,76.5 42,76.5 42,61.5 37,61.5 37,58.5 42.5,58.5 45.5,61.5 45.5,68.5 57.5,68.5

### Text on the board
tNames: +VBATT | HV OUT | GND | GND_HV | *** WARNING / HV PRESENT ***